# EasyEDA Pro project ProPrj_电刺激发生单元_openTENS_2025-11-25.epro

# Schematic Schematic1
Board Name: 交流脉冲版_v1.1; Create Date: 2024-01-28; Page Name: P1; Project Name: 电刺激发生单元2; Schematic Name: Schematic1; Update Date: 2025-10-31; Company: 嘉立创EDA; Page Size: A4; Version: V1.0
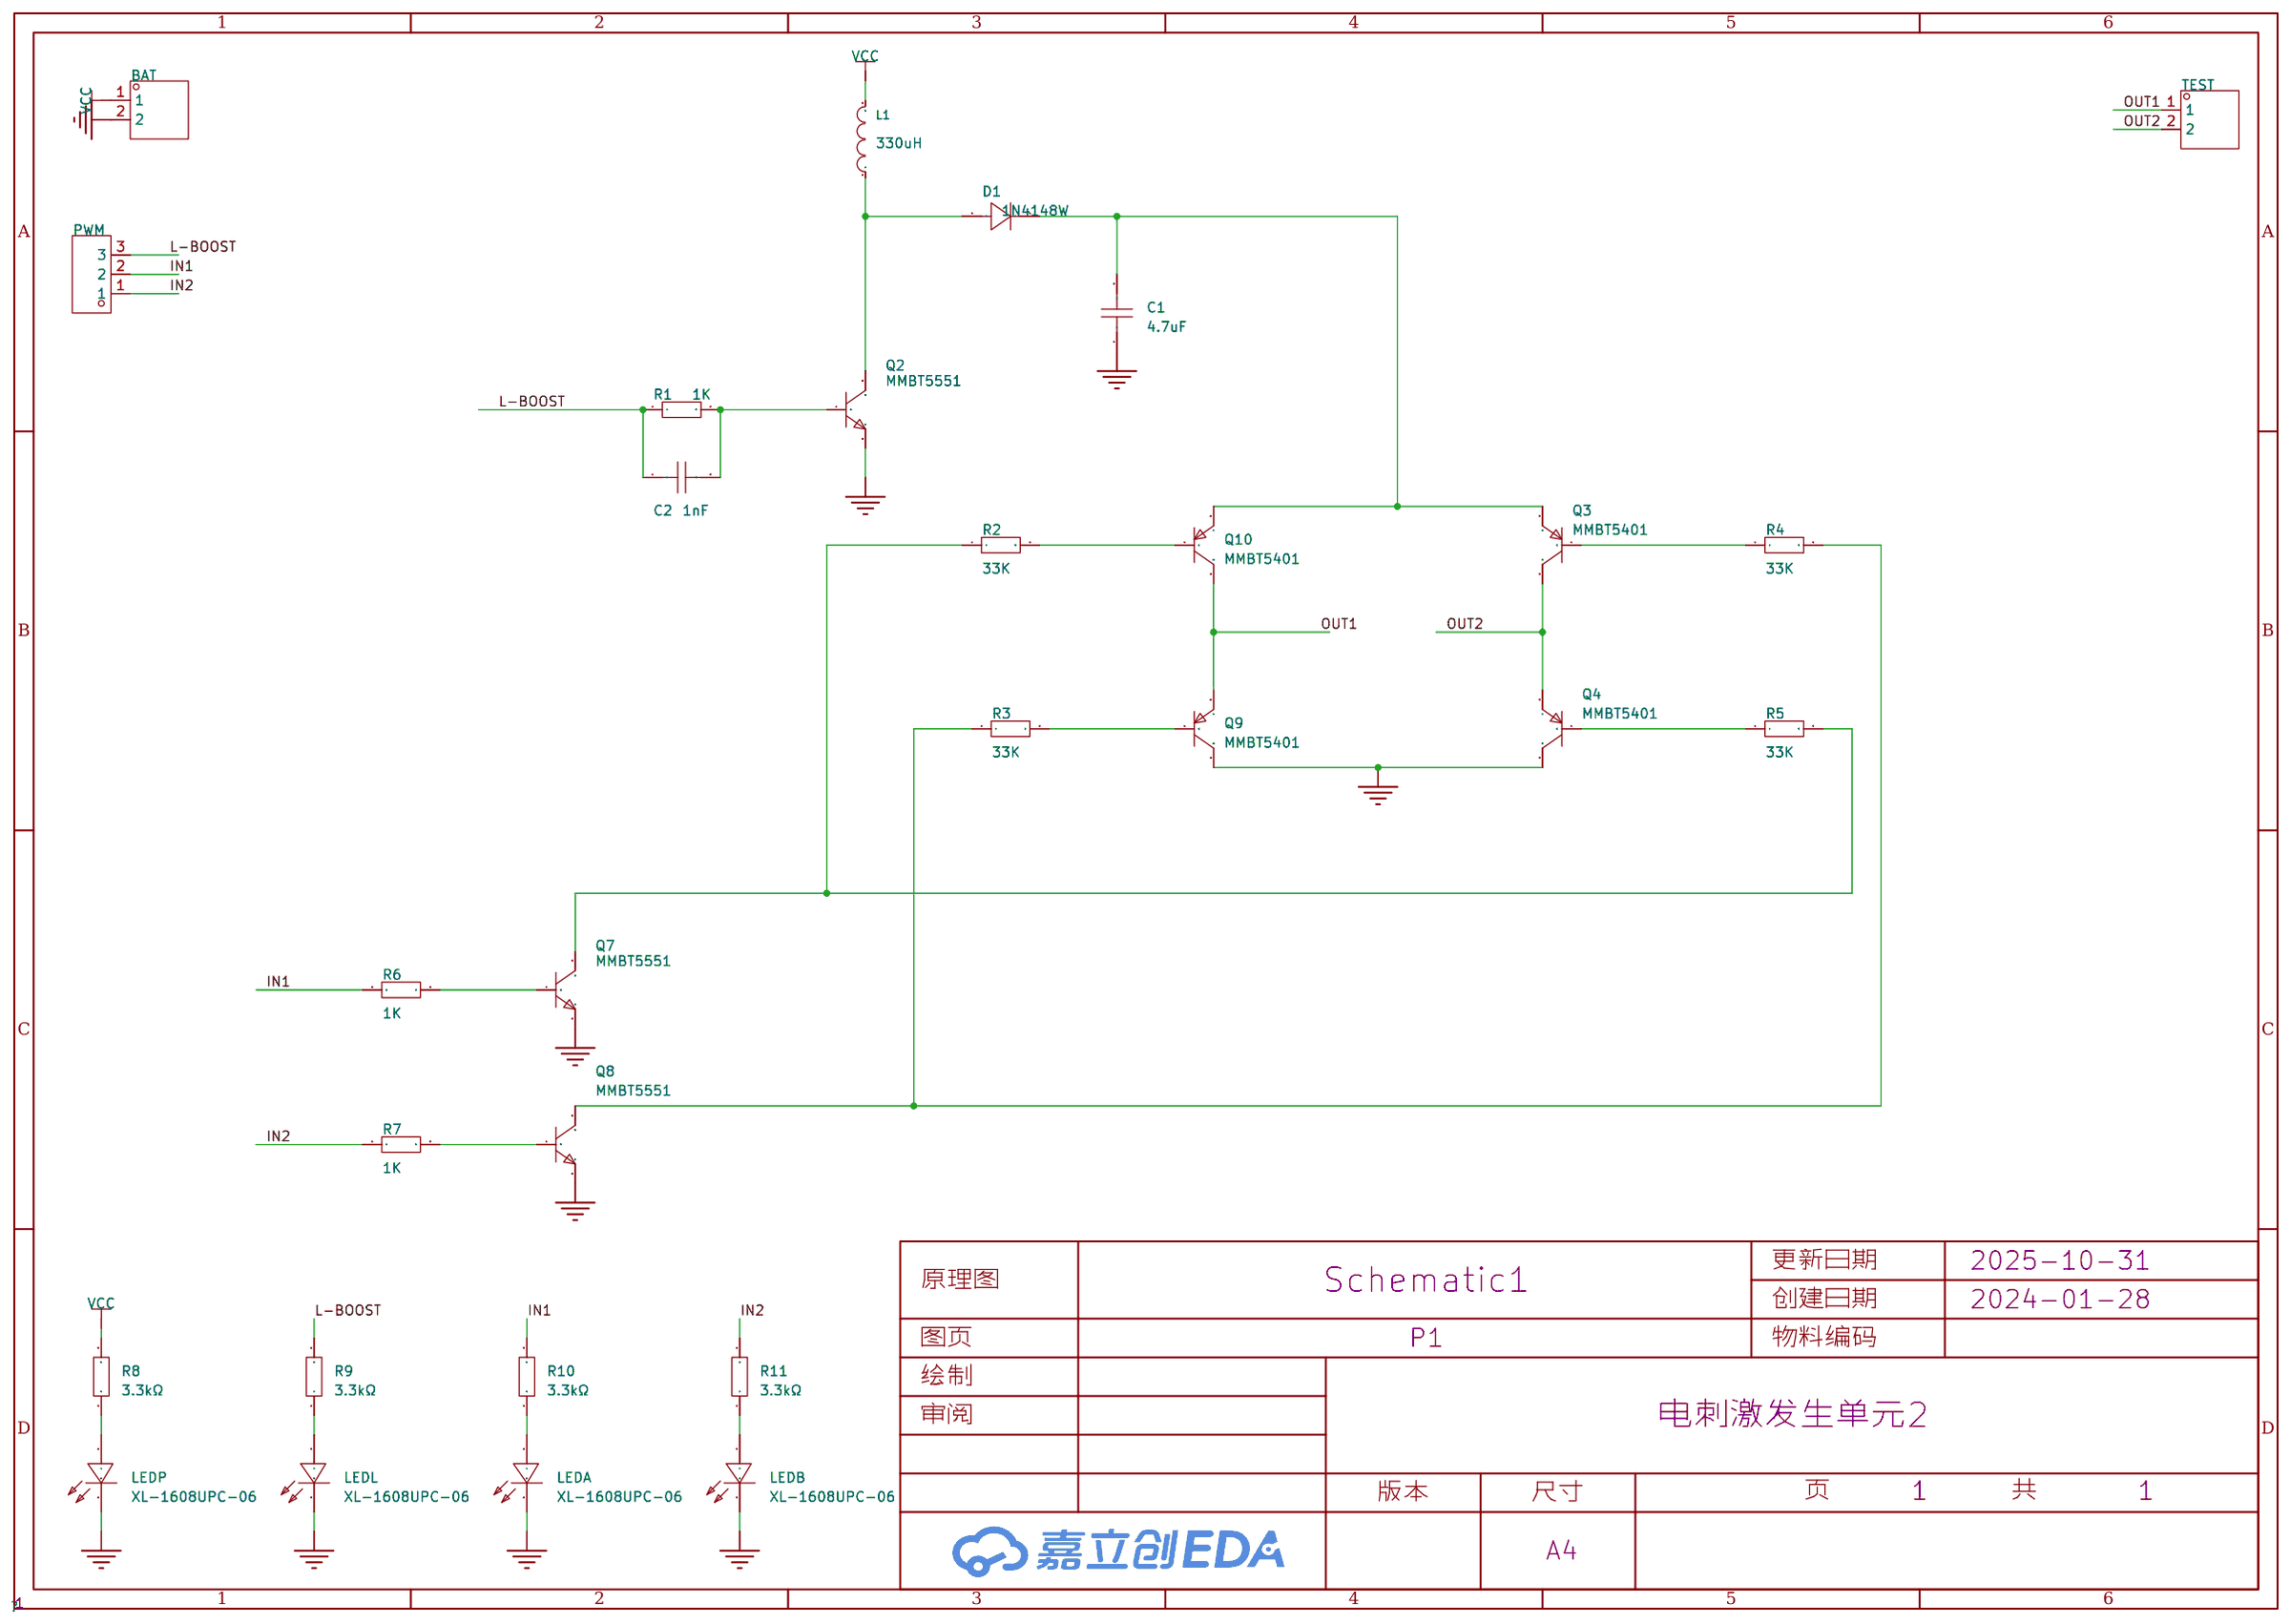
[diagram p0: schematic sheet]

## Parts
BAT  -  [HDR-TH_2P-P2.54-V-M-1]
C1  4.7uF  [C1206]
C2  1nF  [C0603]
D1  1N4148W  [SOD-123_L2.8-W1.8-LS3.7-RD]
L1  330uH  [IND-SMD_L4.0-W4.0_FNR40XXS]
LEDA  XL-1608UPC-06  [LED0603-RD_PINK]
LEDB  XL-1608UPC-06  [LED0603-RD_PINK]
LEDL  XL-1608UPC-06  [LED0603-RD_PINK]
LEDP  XL-1608UPC-06  [LED0603-RD_PINK]
PWM  -  [HDR-TH_3P-P2.54-V-M]
Q2  MMBT5551  [SOT-23-3_L2.9-W1.3-P1.90-LS2.4-BR]
Q3  MMBT5401  [SOT-23-3_L2.9-W1.3-P1.90-LS2.4-BR]
Q4  MMBT5401  [SOT-23-3_L2.9-W1.3-P1.90-LS2.4-BR]
Q7  MMBT5551  [SOT-23-3_L2.9-W1.3-P1.90-LS2.4-BR]
Q8  MMBT5551  [SOT-23-3_L2.9-W1.3-P1.90-LS2.4-BR]
Q9  MMBT5401  [SOT-23-3_L2.9-W1.3-P1.90-LS2.4-BR]
Q10  MMBT5401  [SOT-23-3_L2.9-W1.3-P1.90-LS2.4-BR]
R1  1K  [R0603]
R2  33K  [R0603]
R3  33K  [R0603]
R4  33K  [R0603]
R5  33K  [R0603]
R6  1K  [R0603]
R7  1K  [R0603]
R8  3.3kΩ  [R0603]
R9  3.3kΩ  [R0603]
R10  3.3kΩ  [R0603]
R11  3.3kΩ  [R0603]
TEST  -  [HDR-TH_2P-P2.54-V-M-1]

## Library data of the parts
BAT TEST = HDR-M_2.54_1x2P: Supplier Part: C124375; Supplier Footprint: 插件
C1 = GRM31CC72A475KE11L: 容值:4.7uF;精度:±10%;额定电压:100V;材质(温度系数):X7S;; LCSC Part Name: 4.7uF ±10% 100V; Supplier Part: C237304; Manufacturer: muRata(村田); Supplier Footprint: 1206; JLCPCB Part Class: 扩展库; Datasheet: https://atta.szlcsc.com/upload/public/pdf/source/20200508/C237304_4DE028CC8A94E401326C46A1633456FC.pdf; Supplier: LCSC; Tolerance: ±10%; Voltage Rated: 100V; Temperature Coefficient: X7S
C2 = CL10B102KC8NNNC: 容值:1nF;精度:±10%;额定电压:100V;材质(温度系数):X7R;; LCSC Part Name: 1nF ±10% 100V; Supplier Part: C153291; Manufacturer: SAMSUNG(三星); Supplier Footprint: 0603; JLCPCB Part Class: Extended Part; Datasheet: https://atta.szlcsc.com/upload/public/pdf/source/20160218/1457707763339.pdf; Supplier: LCSC; Tolerance: ±10%; Voltage Rated: 100V; Temperature Coefficient: X7R
D1 = 1N4148W_C2099: 二极管配置:独立式;正向压降(Vf):1.25V@150mA;直流反向耐压(Vr):100V;整流电流:150mA;反向恢复时间(trr):4ns;; LCSC Part Name: 丝印T4; Supplier Part: C2099; Manufacturer: CJ(江苏长电/长晶); Supplier Footprint: SOD-123; JLCPCB Part Class: Extended Part; Datasheet: https://atta.szlcsc.com/upload/public/pdf/source/20120428/1457706480199.pdf; Supplier: LCSC; Diode Configuration: 独立式; Forward Voltage (Vf@If): 1.25V@150mA; Reverse Voltage (Vr): 100V; Rectified Current: 150mA; Reverse Leakage Current: 1uA@75V; Reverse Recovery Time (trr): 4ns
L1 = FNR4030S331MT: 电感值:330uH;精度:±20%;额定电流:260mA;饱和电流(Isat):400mA;; LCSC Part Name: 330uH ±20% 400mA; Supplier Part: C167900; Manufacturer: cjiang(长江微电); Supplier Footprint: SMD,4x4x3mm; JLCPCB Part Class: Extended Part; Datasheet: https://atta.szlcsc.com/upload/public/pdf/source/20190327/C167925_9EFF0AABC4CA629C2CC95961DBF7D39D.pdf; Supplier: LCSC; Tolerance: ±20%; Rated Current: 260mA; DC Resistance (DCR): 5.2Ω; Saturation Current (Isat): 400mA
LEDA LEDB LEDL LEDP = XL-1608UPC-06: 灯头类型:-;发光颜色:粉色;正向电压(VF):-;功率:80mW;正向电流:5mA;主波长:-;二极管配置:-;透镜颜色:粉色透镜;色温:-;发光强度:-;发光角度:120°;载带方式:正贴;工作温度:-30℃~+85℃;; Supplier Part: C2977076; Manufacturer: XINGLIGHT(成兴光); Supplier Footprint: 0603; JLCPCB Part Class: 扩展库; Datasheet: https://atta.szlcsc.com/upload/public/pdf/source/20221102/10CD74551B91639B3CF9699D266872B7.pdf; Supplier: LCSC; Emitted Color: 粉色; Power Dissipation: 80mW; Forward Current: 5mA; Lens Color: 粉色透镜; Viewing Angle: 120°; Mounting Sytle: 正贴; Operating Temperature: -30℃~+85℃
PWM = HDR-M_2.54_1x3P: Supplier Part: C2937625; Supplier Footprint: 插件
Q2 Q7 Q8 = MMBT5551_C511877: 晶体管类型:-;集电极电流(Ic):600mA;集射极击穿电压(Vceo):160V;功率(Pd):300mW;直流电流增益(hFE@Ic,Vce):100@10mA,5V;; LCSC Part Name: 电流:600mA 耐压:160V; Supplier Part: C511877; Manufacturer: BORN(伯恩半导体); Supplier Footprint: SOT-23; JLCPCB Part Class: 扩展库; Datasheet: https://atta.szlcsc.com/upload/public/pdf/source/20200413/C511877_5FB572CA080610ED71DCB0A2B79AF8E8.pdf; Supplier: LCSC; Collector Current (Ic): 600mA; Collector-Emitter Breakdown Voltage (Vceo): 160V; Power Dissipation (Pd): 300mW; DC Current Gain (hFE@Ic,Vce): 100@10mA,5V; Transition Frequency (fT): 300MHz; Collector Cut-Off Current (Icbo): 50nA; Collector-Emitter Saturation Voltage (VCE(sat)@Ic,Ib): 200mV@50mA,5mA
Q3 Q4 Q9 Q10 = MMBT5401_C8326: 晶体管类型:PNP;集电极电流(Ic):600mA;集射极击穿电压(Vceo):150V;功率(Pd):300mW;直流电流增益(hFE@Ic,Vce):200@10mA,5V;; LCSC Part Name: PNP 电流:600mA 耐压:150V hfe=200~300; Supplier Part: C8326; Manufacturer: CJ(江苏长电/长晶); Supplier Footprint: SOT-23; JLCPCB Part Class: 基础库; Datasheet: https://atta.szlcsc.com/upload/public/pdf/source/20140809/1457707213644.pdf; Supplier: LCSC; Transistor Type: PNP; Collector Current (Ic): 600mA; Collector-Emitter Breakdown Voltage (Vceo): 150V; Power Dissipation (Pd): 300mW; DC Current Gain (hFE@Ic,Vce): 200@10mA,5V; Transition Frequency (fT): 100MHz; Collector Cut-Off Current (Icbo): 100nA; Collector-Emitter Saturation Voltage (VCE(sat)@Ic,Ib): 500mV@50mA,5mA
R1-R7 = Res_0603: Supplier Footprint: 0603
R8-R11 = 0603WAF3301T5E: 阻值:3.3kΩ;精度:±1%;功率:100mW;温度系数:±100ppm/℃;电阻类型:厚膜电阻;; LCSC Part Name: 3.3kΩ ±1% 100mW 厚膜电阻; Supplier Part: C22978; Manufacturer: UNI-ROYAL(厚声); Supplier Footprint: 0603; JLCPCB Part Class: 基础库; Datasheet: https://atta.szlcsc.com/upload/public/pdf/source/20200306/C422600_1E6D84923E4A46A82E41ADD87F860B5C.pdf; Supplier: LCSC; Tolerance: ±1%; Power(Watts): 100mW; Overload Voltage (Max): 75V; Temperature Coefficient: ±100ppm/℃; Type: 厚膜电阻; Operating Temperature Range: -55℃~+155℃

## Nets
GND: BAT.2 C1.1 LEDA.1(C) LEDB.1(C) LEDL.1(C) LEDP.1(C) Q2.2(E) Q4.3(C) Q7.2(E) Q8.2(E) Q9.3(C)
VCC: BAT.1 L1.2 R8.2
IN1: PWM.2 R6.1 R10.2
IN2: PWM.1 R7.1 R11.2
L-BOOST: C2.1 PWM.3 R1.1 R9.2
OUT1: Q9.2(E) Q10.3(C) TEST.1
OUT2: Q3.3(C) Q4.2(E) TEST.2
$1N633: C2.2 Q2.1(B) R1.2
$1N635: C1.2 D1.1(K) Q3.2(E) Q10.2(E)
$1N636: Q10.1(B) R2.2
$1N637: Q4.1(B) R5.1
$1N638: Q9.1(B) R3.2
$1N639: Q7.3(C) R2.1 R5.2
$1N640: Q3.1(B) R4.1
$1N641: Q8.3(C) R3.1 R4.2
$1N644: Q7.1(B) R6.2
$1N645: Q8.1(B) R7.2
$1N1569: D1.2(A) L1.1 Q2.3(C)
$1N3237: LEDP.2(A) R8.1
$1N5710: LEDL.2(A) R9.1
$1N5808: LEDA.2(A) R10.1
$1N5903: LEDB.2(A) R11.1

# Schematic Schematic2
Board Name: 直流脉冲版_v1.0; Create Date: 2024-02-03; Page Name: P1; Project Name: 电刺激发生单元2; Schematic Name: Schematic2; Update Date: 2025-10-31; Company: 嘉立创EDA; Page Size: A4; Version: V1.0
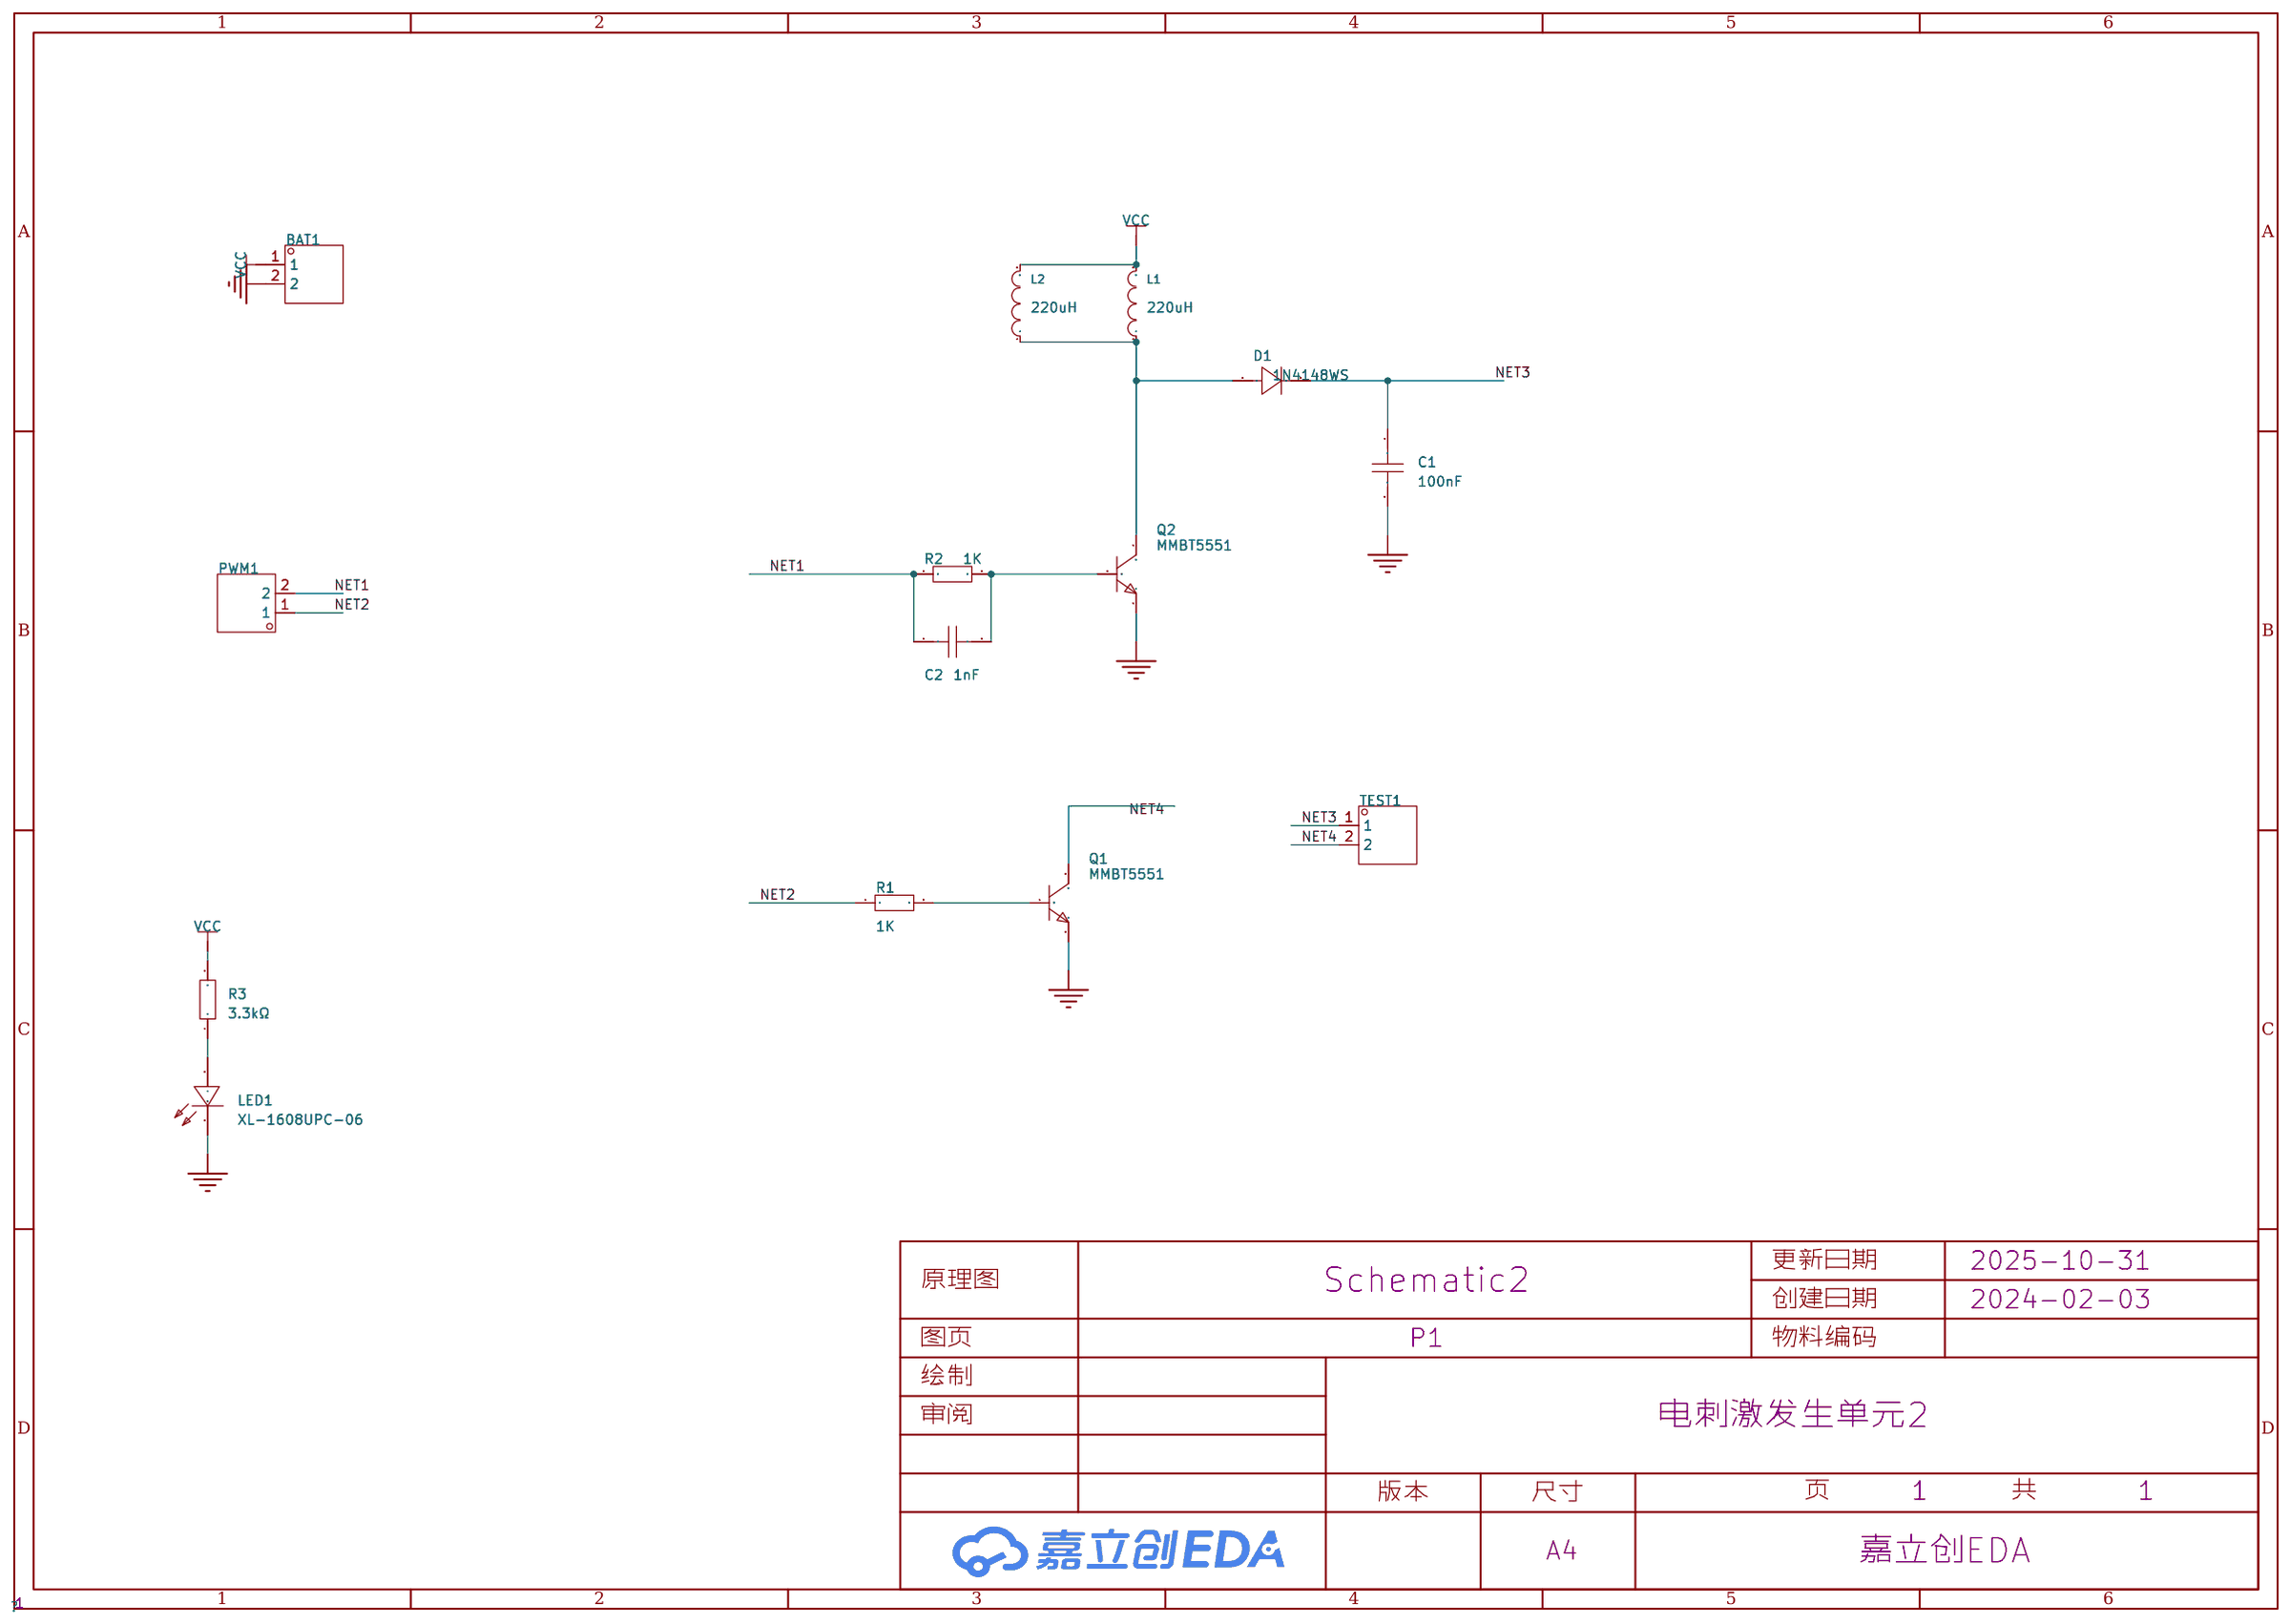
[diagram p1: schematic sheet]

## Parts
BAT1  -  [HDR-TH_2P-P2.54-V-M-1]
C1  100nF  [C1206]
C2  1nF  [C0603]
D1  1N4148WS  [SOD-323_L1.8-W1.3-LS2.5-RD]
L1  220uH  [IND-SMD_L3.0-W3.0_LVS303015H-2R2M-N]
L2  220uH  [L1207]
LED1  XL-1608UPC-06  [LED0603-RD_PINK]
PWM1  -  [HDR-TH_2P-P2.54-V-M-1]
Q1  MMBT5551  [SOT-23-3_L2.9-W1.3-P1.90-LS2.4-BR]
Q2  MMBT5551  [SOT-23-3_L2.9-W1.3-P1.90-LS2.4-BR]
R1  1K  [R0603]
R2  1K  [R0603]
R3  3.3kΩ  [R0603]
TEST1  -  [HDR-TH_2P-P2.54-V-M-1]

## Library data of the parts
BAT1 PWM1 TEST1 = HDR-M_2.54_1x2P: Supplier Part: C124375; Supplier Footprint: 插件
C1 = 1206B104K101NT: 容值:100nF;精度:±10%;额定电压:100V;材质(温度系数):X7R;; LCSC Part Name: 100nF ±10% 100V; Supplier Part: C110255; Manufacturer: FH(风华); Supplier Footprint: 1206; JLCPCB Part Class: Extended Part; Datasheet: https://atta.szlcsc.com/upload/public/pdf/source/20200305/C486355_26A10D38EF8C2A5C37091D0039909270.pdf; Supplier: LCSC; Tolerance: ±10%; Voltage Rated: 100V; Temperature Coefficient: X7R
C2 = CL10B102KC8NNNC: 容值:1nF;精度:±10%;额定电压:100V;材质(温度系数):X7R;; LCSC Part Name: 1nF ±10% 100V; Supplier Part: C153291; Manufacturer: SAMSUNG(三星); Supplier Footprint: 0603; JLCPCB Part Class: Extended Part; Datasheet: https://atta.szlcsc.com/upload/public/pdf/source/20160218/1457707763339.pdf; Supplier: LCSC; Tolerance: ±10%; Voltage Rated: 100V; Temperature Coefficient: X7R
D1 = 1N4148WS_C727111: 二极管配置:独立式;正向压降(Vf):1.25V@150mA;直流反向耐压(Vr):100V;平均整流电流(Io):300mA;功率:400mW;反向恢复时间(trr):8ns;; LCSC Part Name: 电压:100V 电流:300mA; Supplier Part: C727111; Manufacturer: TWGMC(台湾迪嘉); Supplier Footprint: SOD-323; JLCPCB Part Class: Extended Part; Datasheet: https://atta.szlcsc.com/upload/public/pdf/source/20200828/C727111_E7108F014A9288D320E3440593CCDF54.pdf; Supplier: LCSC; Diode Configuration: 独立式; Forward Voltage (Vf@If): 1.25V@150mA; Reverse Voltage (Vr): 100V; Average Rectified Current (Io): 300mA; Power Dissipation: 400mW; Reverse Leakage Current: 1uA@75V; Reverse Recovery Time (trr): 8ns; Operating Temperature: -55℃~+150℃@(Tj)
L1 = XRCD32-221K: 电感值:220uH;精度:±10%;; LCSC Part Name: 220uH ±10%; Supplier Part: C5289391; Manufacturer: XR(祥如); Supplier Footprint: SMD,2.1x3mm; JLCPCB Part Class: Extended Part; Datasheet: https://atta.szlcsc.com/upload/public/pdf/source/20231010/F8DFC35BD01DC108FC822E3F44DEF6B3.pdf; Supplier: LCSC; Tolerance: ±10%; Rated Current: 260mA; DC Resistance (DCR): 5.2Ω; Saturation Current (Isat): 400mA
L2 = LB3218T221M: 电感值:220uH;精度:±20%;额定电流:80mA;饱和电流(Isat):-;直流电阻(DCR):5.4Ω;; LCSC Part Name: 220uH ±20%; Supplier Part: C223393; Manufacturer: TAIYO YUDEN(太诱); Supplier Footprint: 1206; JLCPCB Part Class: Extended Part; Datasheet: https://atta.szlcsc.com/upload/public/pdf/source/20190423/C223308_BFD65E337BAACD8D50F53C3994BF310F.pdf; Supplier: LCSC; Tolerance: ±20%; Rated Current: 80mA; DC Resistance (DCR): 5.4Ω; Frequency - Self Resonant: 252kHz; Type: 绕线片式电感
LED1 = XL-1608UPC-06: 灯头类型:-;发光颜色:粉色;正向电压(VF):-;功率:80mW;正向电流:5mA;主波长:-;二极管配置:-;透镜颜色:粉色透镜;色温:-;发光强度:-;发光角度:120°;载带方式:正贴;工作温度:-30℃~+85℃;; Supplier Part: C2977076; Manufacturer: XINGLIGHT(成兴光); Supplier Footprint: 0603; JLCPCB Part Class: 扩展库; Datasheet: https://atta.szlcsc.com/upload/public/pdf/source/20221102/10CD74551B91639B3CF9699D266872B7.pdf; Supplier: LCSC; Emitted Color: 粉色; Power Dissipation: 80mW; Forward Current: 5mA; Lens Color: 粉色透镜; Viewing Angle: 120°; Mounting Sytle: 正贴; Operating Temperature: -30℃~+85℃
Q1 Q2 = MMBT5551_C511877: 晶体管类型:-;集电极电流(Ic):600mA;集射极击穿电压(Vceo):160V;功率(Pd):300mW;直流电流增益(hFE@Ic,Vce):100@10mA,5V;; LCSC Part Name: 电流:600mA 耐压:160V; Supplier Part: C511877; Manufacturer: BORN(伯恩半导体); Supplier Footprint: SOT-23; JLCPCB Part Class: 扩展库; Datasheet: https://atta.szlcsc.com/upload/public/pdf/source/20200413/C511877_5FB572CA080610ED71DCB0A2B79AF8E8.pdf; Supplier: LCSC; Collector Current (Ic): 600mA; Collector-Emitter Breakdown Voltage (Vceo): 160V; Power Dissipation (Pd): 300mW; DC Current Gain (hFE@Ic,Vce): 100@10mA,5V; Transition Frequency (fT): 300MHz; Collector Cut-Off Current (Icbo): 50nA; Collector-Emitter Saturation Voltage (VCE(sat)@Ic,Ib): 200mV@50mA,5mA
R1 R2 = Res_0603: Supplier Footprint: 0603
R3 = 0603WAF3301T5E: 阻值:3.3kΩ;精度:±1%;功率:100mW;温度系数:±100ppm/℃;电阻类型:厚膜电阻;; LCSC Part Name: 3.3kΩ ±1% 100mW 厚膜电阻; Supplier Part: C22978; Manufacturer: UNI-ROYAL(厚声); Supplier Footprint: 0603; JLCPCB Part Class: 基础库; Datasheet: https://atta.szlcsc.com/upload/public/pdf/source/20200306/C422600_1E6D84923E4A46A82E41ADD87F860B5C.pdf; Supplier: LCSC; Tolerance: ±1%; Power(Watts): 100mW; Overload Voltage (Max): 75V; Temperature Coefficient: ±100ppm/℃; Type: 厚膜电阻; Operating Temperature Range: -55℃~+155℃

## Nets
GND: BAT1.2 C1.2 LED1.1(C) Q1.2(E) Q2.2(E)
VCC: BAT1.1 L1.2 L2.2 R3.2
NET1: C2.1 PWM1.2 R2.1
NET2: PWM1.1 R1.1
NET3: C1.1 D1.1(K) TEST1.1
NET4: Q1.3(C) TEST1.2
$1N914: C2.2 Q2.1(B) R2.2
$1N925: Q1.1(B) R1.2
$1N950: LED1.2(A) R3.1
$1N1295: D1.2(A) L1.1 L2.1 Q2.3(C)

# Schematic Schematic3
Board Name: 开源_交流脉冲版_v2; Create Date: 2025-11-19; Page Name: P1; Project Name: 电刺激发生单元2; Schematic Name: Schematic1_1; Update Date: 2025-11-19; Company: 嘉立创EDA; Page Size: A4; Version: V1.0
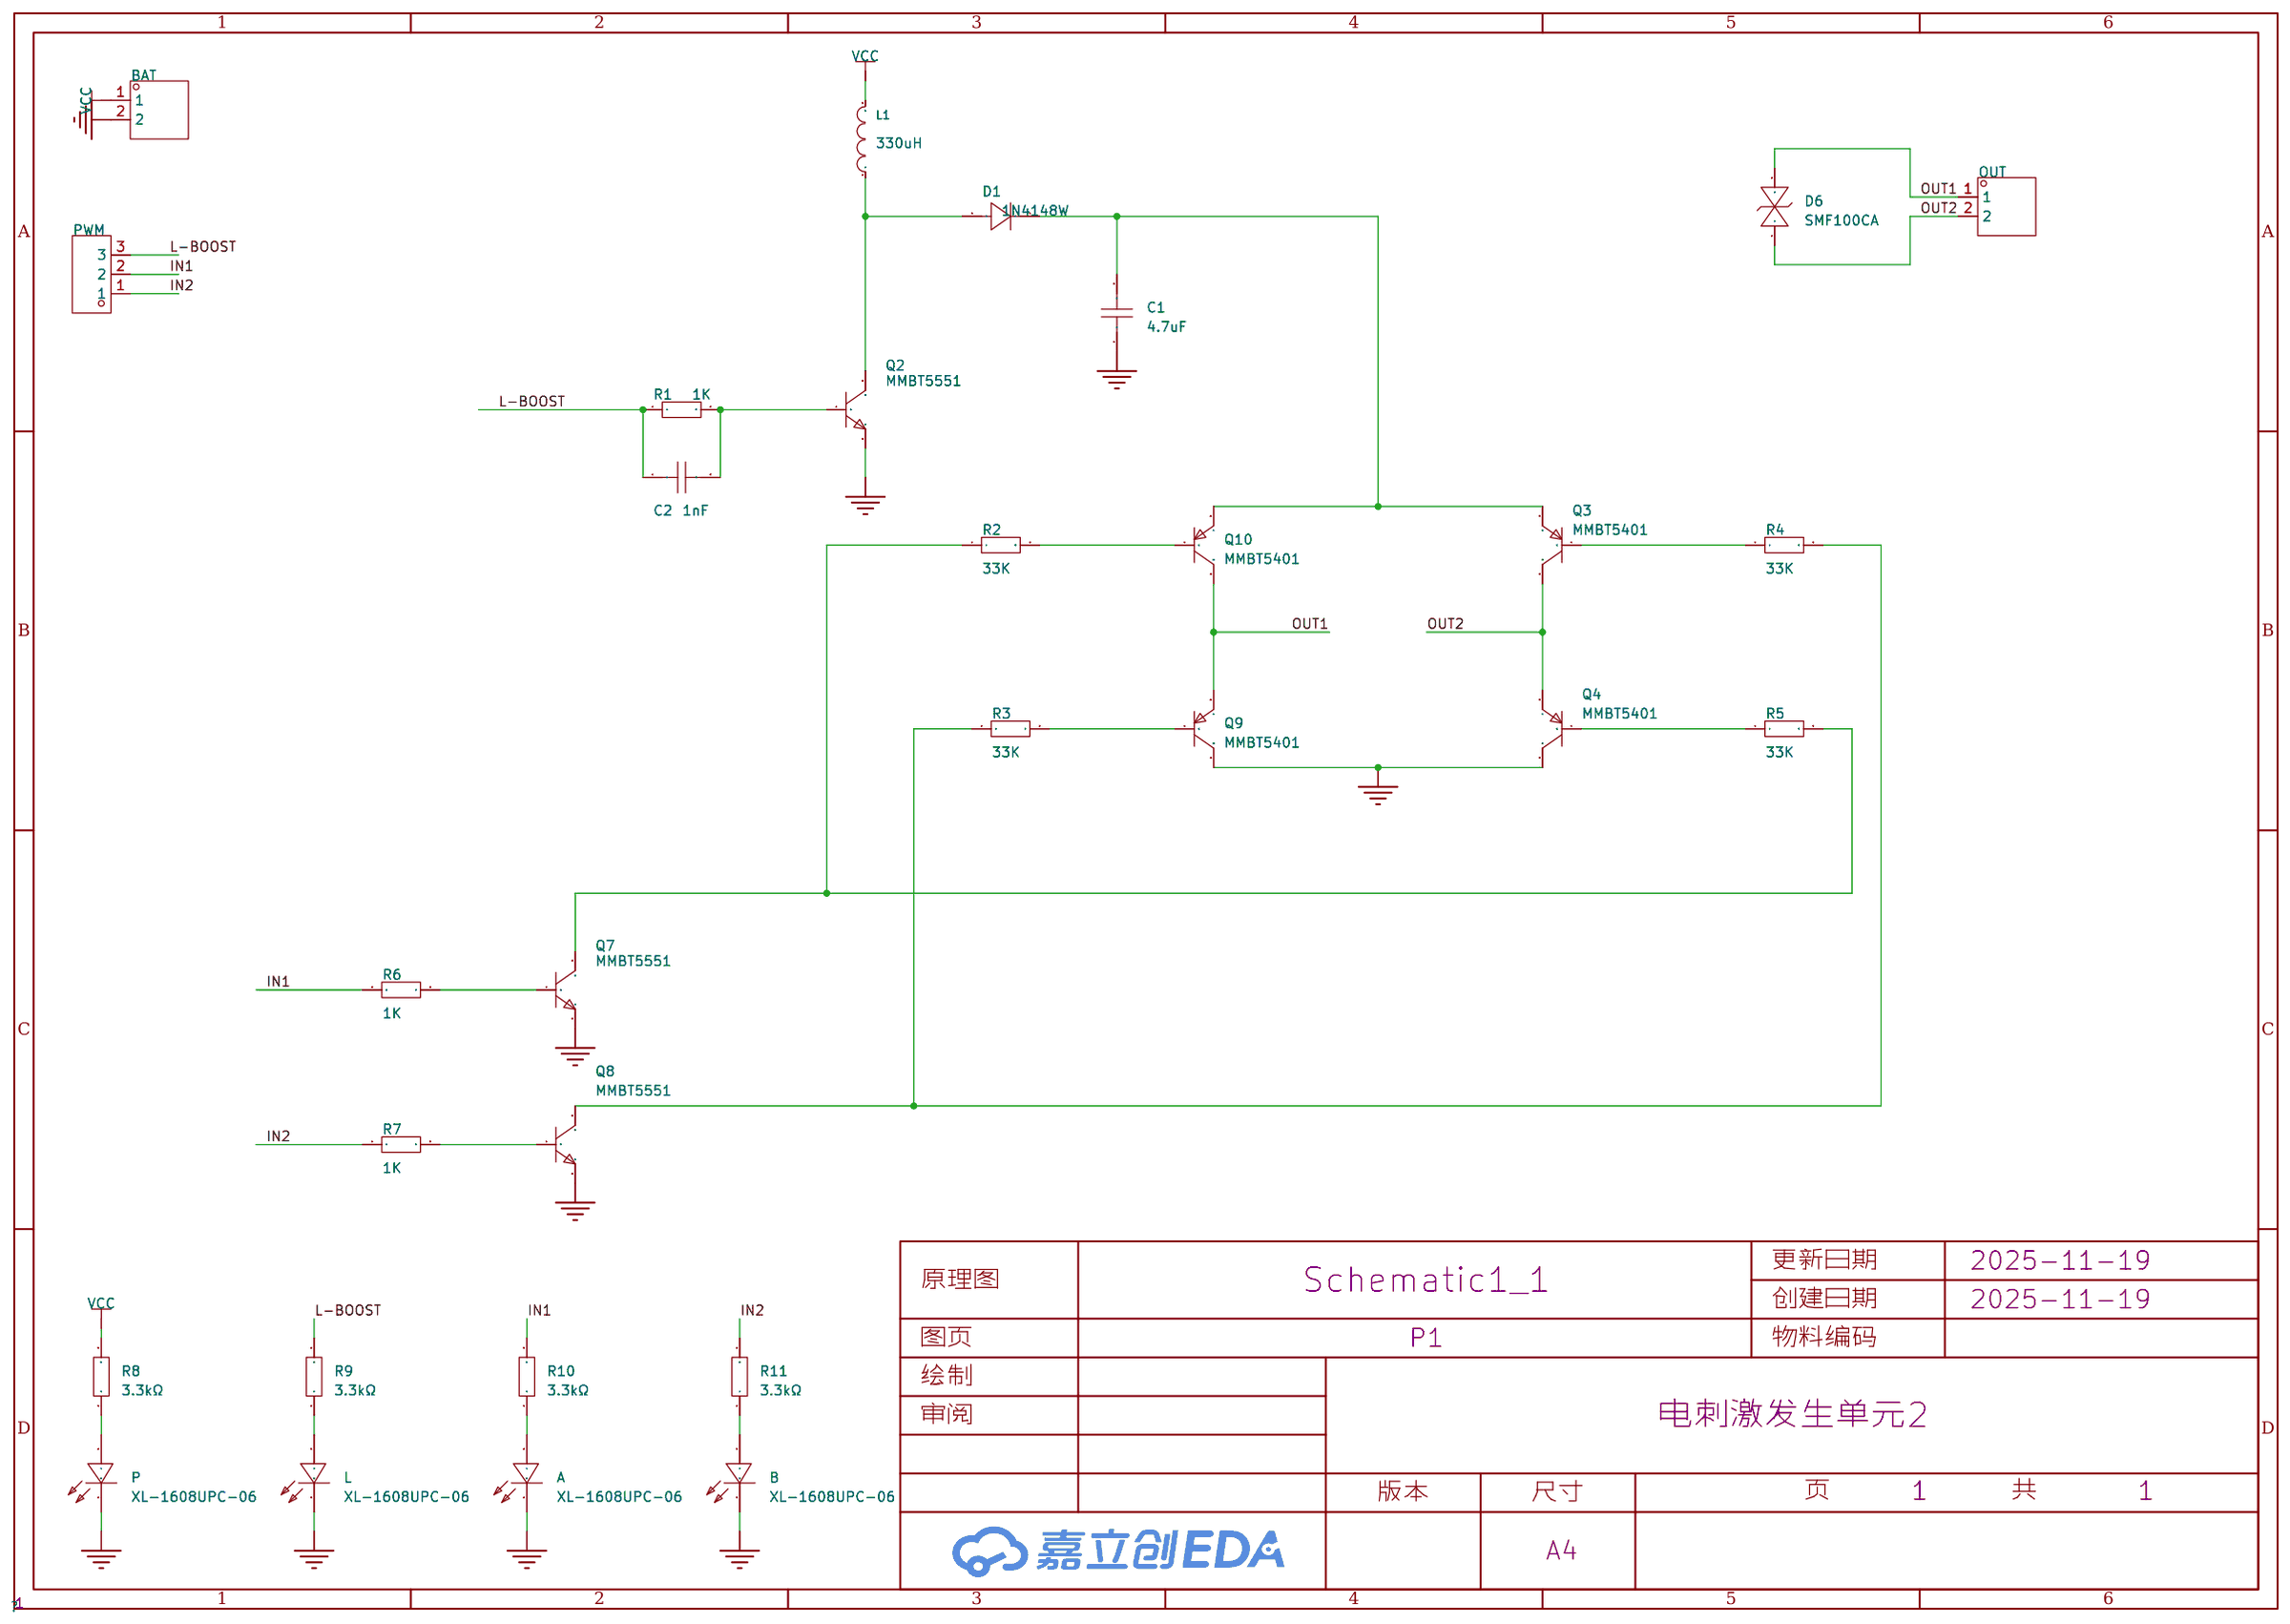
[diagram p2: schematic sheet]

## Parts
A  XL-1608UPC-06  [LED0603-RD_PINK]
B  XL-1608UPC-06  [LED0603-RD_PINK]
BAT  -  [HDR-TH_2P-P2.54-V-M-1]
C1  4.7uF  [C1206]
C2  1nF  [C0603]
D1  1N4148W  [SOD-123_L2.8-W1.8-LS3.7-RD]
D6  SMF100CA  [SOD-123FL_L2.8-W1.8-LS3.7-BI]
L  XL-1608UPC-06  [LED0603-RD_PINK]
L1  330uH  [IND-SMD_L4.0-W4.0_FNR40XXS]
OUT  -  [HDR-TH_2P-P2.54-V-M-1]
P  XL-1608UPC-06  [LED0603-RD_PINK]
PWM  -  [HDR-TH_3P-P2.54-V-M]
Q2  MMBT5551  [SOT-23-3_L2.9-W1.3-P1.90-LS2.4-BR]
Q3  MMBT5401  [SOT-23-3_L2.9-W1.3-P1.90-LS2.4-BR]
Q4  MMBT5401  [SOT-23-3_L2.9-W1.3-P1.90-LS2.4-BR]
Q7  MMBT5551  [SOT-23-3_L2.9-W1.3-P1.90-LS2.4-BR]
Q8  MMBT5551  [SOT-23-3_L2.9-W1.3-P1.90-LS2.4-BR]
Q9  MMBT5401  [SOT-23-3_L2.9-W1.3-P1.90-LS2.4-BR]
Q10  MMBT5401  [SOT-23-3_L2.9-W1.3-P1.90-LS2.4-BR]
R1  1K  [R0603]
R2  33K  [R0603]
R3  33K  [R0603]
R4  33K  [R0603]
R5  33K  [R0603]
R6  1K  [R0603]
R7  1K  [R0603]
R8  3.3kΩ  [R0603]
R9  3.3kΩ  [R0603]
R10  3.3kΩ  [R0603]
R11  3.3kΩ  [R0603]

## Library data of the parts
A B L P = XL-1608UPC-06: 灯头类型:-;发光颜色:粉色;正向电压(VF):-;功率:80mW;正向电流:5mA;主波长:-;二极管配置:-;透镜颜色:粉色透镜;色温:-;发光强度:-;发光角度:120°;载带方式:正贴;工作温度:-30℃~+85℃;; Supplier Part: C2977076; Manufacturer: XINGLIGHT(成兴光); Supplier Footprint: 0603; JLCPCB Part Class: 扩展库; Datasheet: https://atta.szlcsc.com/upload/public/pdf/source/20221102/10CD74551B91639B3CF9699D266872B7.pdf; Supplier: LCSC; Emitted Color: 粉色; Power Dissipation: 80mW; Forward Current: 5mA; Lens Color: 粉色透镜; Viewing Angle: 120°; Mounting Sytle: 正贴; Operating Temperature: -30℃~+85℃
BAT OUT = HDR-M_2.54_1x2P: Supplier Part: C124375; Supplier Footprint: 插件
C1 = GRM31CC72A475KE11L: 容值:4.7uF;精度:±10%;额定电压:100V;材质(温度系数):X7S;; LCSC Part Name: 4.7uF ±10% 100V; Supplier Part: C237304; Manufacturer: muRata(村田); Supplier Footprint: 1206; JLCPCB Part Class: 扩展库; Datasheet: https://atta.szlcsc.com/upload/public/pdf/source/20200508/C237304_4DE028CC8A94E401326C46A1633456FC.pdf; Supplier: LCSC; Tolerance: ±10%; Voltage Rated: 100V; Temperature Coefficient: X7S
C2 = CL10B102KC8NNNC: 容值:1nF;精度:±10%;额定电压:100V;材质(温度系数):X7R;; LCSC Part Name: 1nF ±10% 100V; Supplier Part: C153291; Manufacturer: SAMSUNG(三星); Supplier Footprint: 0603; JLCPCB Part Class: Extended Part; Datasheet: https://atta.szlcsc.com/upload/public/pdf/source/20160218/1457707763339.pdf; Supplier: LCSC; Tolerance: ±10%; Voltage Rated: 100V; Temperature Coefficient: X7R
D1 = 1N4148W_C2099: 二极管配置:独立式;正向压降(Vf):1.25V@150mA;直流反向耐压(Vr):100V;整流电流:150mA;反向恢复时间(trr):4ns;; LCSC Part Name: 丝印T4; Supplier Part: C2099; Manufacturer: CJ(江苏长电/长晶); Supplier Footprint: SOD-123; JLCPCB Part Class: Extended Part; Datasheet: https://atta.szlcsc.com/upload/public/pdf/source/20120428/1457706480199.pdf; Supplier: LCSC; Diode Configuration: 独立式; Forward Voltage (Vf@If): 1.25V@150mA; Reverse Voltage (Vr): 100V; Rectified Current: 150mA; Reverse Leakage Current: 1uA@75V; Reverse Recovery Time (trr): 4ns
D6 = SMF100CA_C726978: 极性:双向;反向截止电压(Vrwm):100V;最大钳位电压:162V;峰值脉冲电流(Ipp):1.1A;峰值脉冲功率(Ppp):200W;击穿电压:123V;; Supplier Part: C726978; Manufacturer: TWGMC(台湾迪嘉); Supplier Footprint: SOD-123FL; JLCPCB Part Class: Extended Part; Datasheet: https://atta.szlcsc.com/upload/public/pdf/source/20240221/82542CC24D3FF23C8D7724B636AB7D4B.pdf; Supplier: LCSC; polarity: 双向; Reverse Stand-Off Voltage (Vrwm): 100V; Maximum Clamping Voltage: 162V; Peak Pulse Current (Ipp): 1.1A; Peak Pulse Power Dissipation (Ppp): 200W; Breakdown Voltage: 123V; Reverse Leakage Current (Ir): 1uA; Number of Lines: 单路; Operating Temperature: -55℃~+150℃; Type: TVS
L1 = FNR4030S331MT: 电感值:330uH;精度:±20%;额定电流:260mA;饱和电流(Isat):400mA;; LCSC Part Name: 330uH ±20% 400mA; Supplier Part: C167900; Manufacturer: cjiang(长江微电); Supplier Footprint: SMD,4x4x3mm; JLCPCB Part Class: Extended Part; Datasheet: https://atta.szlcsc.com/upload/public/pdf/source/20190327/C167925_9EFF0AABC4CA629C2CC95961DBF7D39D.pdf; Supplier: LCSC; Tolerance: ±20%; Rated Current: 260mA; DC Resistance (DCR): 5.2Ω; Saturation Current (Isat): 400mA
PWM = HDR-M_2.54_1x3P: Supplier Part: C2937625; Supplier Footprint: 插件
Q2 Q7 Q8 = MMBT5551_C511877: 晶体管类型:-;集电极电流(Ic):600mA;集射极击穿电压(Vceo):160V;功率(Pd):300mW;直流电流增益(hFE@Ic,Vce):100@10mA,5V;; LCSC Part Name: 电流:600mA 耐压:160V; Supplier Part: C511877; Manufacturer: BORN(伯恩半导体); Supplier Footprint: SOT-23; JLCPCB Part Class: 扩展库; Datasheet: https://atta.szlcsc.com/upload/public/pdf/source/20200413/C511877_5FB572CA080610ED71DCB0A2B79AF8E8.pdf; Supplier: LCSC; Collector Current (Ic): 600mA; Collector-Emitter Breakdown Voltage (Vceo): 160V; Power Dissipation (Pd): 300mW; DC Current Gain (hFE@Ic,Vce): 100@10mA,5V; Transition Frequency (fT): 300MHz; Collector Cut-Off Current (Icbo): 50nA; Collector-Emitter Saturation Voltage (VCE(sat)@Ic,Ib): 200mV@50mA,5mA
Q3 Q4 Q9 Q10 = MMBT5401_C8326: 晶体管类型:PNP;集电极电流(Ic):600mA;集射极击穿电压(Vceo):150V;功率(Pd):300mW;直流电流增益(hFE@Ic,Vce):200@10mA,5V;; LCSC Part Name: PNP 电流:600mA 耐压:150V hfe=200~300; Supplier Part: C8326; Manufacturer: CJ(江苏长电/长晶); Supplier Footprint: SOT-23; JLCPCB Part Class: 基础库; Datasheet: https://atta.szlcsc.com/upload/public/pdf/source/20140809/1457707213644.pdf; Supplier: LCSC; Transistor Type: PNP; Collector Current (Ic): 600mA; Collector-Emitter Breakdown Voltage (Vceo): 150V; Power Dissipation (Pd): 300mW; DC Current Gain (hFE@Ic,Vce): 200@10mA,5V; Transition Frequency (fT): 100MHz; Collector Cut-Off Current (Icbo): 100nA; Collector-Emitter Saturation Voltage (VCE(sat)@Ic,Ib): 500mV@50mA,5mA
R1-R7 = Res_0603: Supplier Footprint: 0603
R8-R11 = 0603WAF3301T5E: 阻值:3.3kΩ;精度:±1%;功率:100mW;温度系数:±100ppm/℃;电阻类型:厚膜电阻;; LCSC Part Name: 3.3kΩ ±1% 100mW 厚膜电阻; Supplier Part: C22978; Manufacturer: UNI-ROYAL(厚声); Supplier Footprint: 0603; JLCPCB Part Class: 基础库; Datasheet: https://atta.szlcsc.com/upload/public/pdf/source/20200306/C422600_1E6D84923E4A46A82E41ADD87F860B5C.pdf; Supplier: LCSC; Tolerance: ±1%; Power(Watts): 100mW; Overload Voltage (Max): 75V; Temperature Coefficient: ±100ppm/℃; Type: 厚膜电阻; Operating Temperature Range: -55℃~+155℃

## Nets
GND: A.1(C) B.1(C) BAT.2 C1.1 L.1(C) P.1(C) Q2.2(E) Q4.3(C) Q7.2(E) Q8.2(E) Q9.3(C)
VCC: BAT.1 L1.2 R8.2
IN1: PWM.2 R6.1 R10.2
IN2: PWM.1 R7.1 R11.2
L-BOOST: C2.1 PWM.3 R1.1 R9.2
OUT1: D6.2 OUT.1 Q9.2(E) Q10.3(C)
OUT2: D6.1 OUT.2 Q3.3(C) Q4.2(E)
$1N633: C2.2 Q2.1(B) R1.2
$1N635: C1.2 D1.1(K) Q3.2(E) Q10.2(E)
$1N636: Q10.1(B) R2.2
$1N637: Q4.1(B) R5.1
$1N638: Q9.1(B) R3.2
$1N639: Q7.3(C) R2.1 R5.2
$1N640: Q3.1(B) R4.1
$1N641: Q8.3(C) R3.1 R4.2
$1N644: Q7.1(B) R6.2
$1N645: Q8.1(B) R7.2
$1N1569: D1.2(A) L1.1 Q2.3(C)
$1N3237: P.2(A) R8.1
$1N5710: L.2(A) R9.1
$1N5808: A.2(A) R10.1
$1N5903: B.2(A) R11.1

# Schematic Schematic4
Board Name: openTense开源_2.54to2.5mm转接板_v1; Create Date: 2025-11-25; Page Name: P1; Project Name: 电刺激发生单元_openTENS; Schematic Name: Schematic4; Update Date: 2025-11-25; Company: 嘉立创EDA; Page Size: A4; Version: V1.0
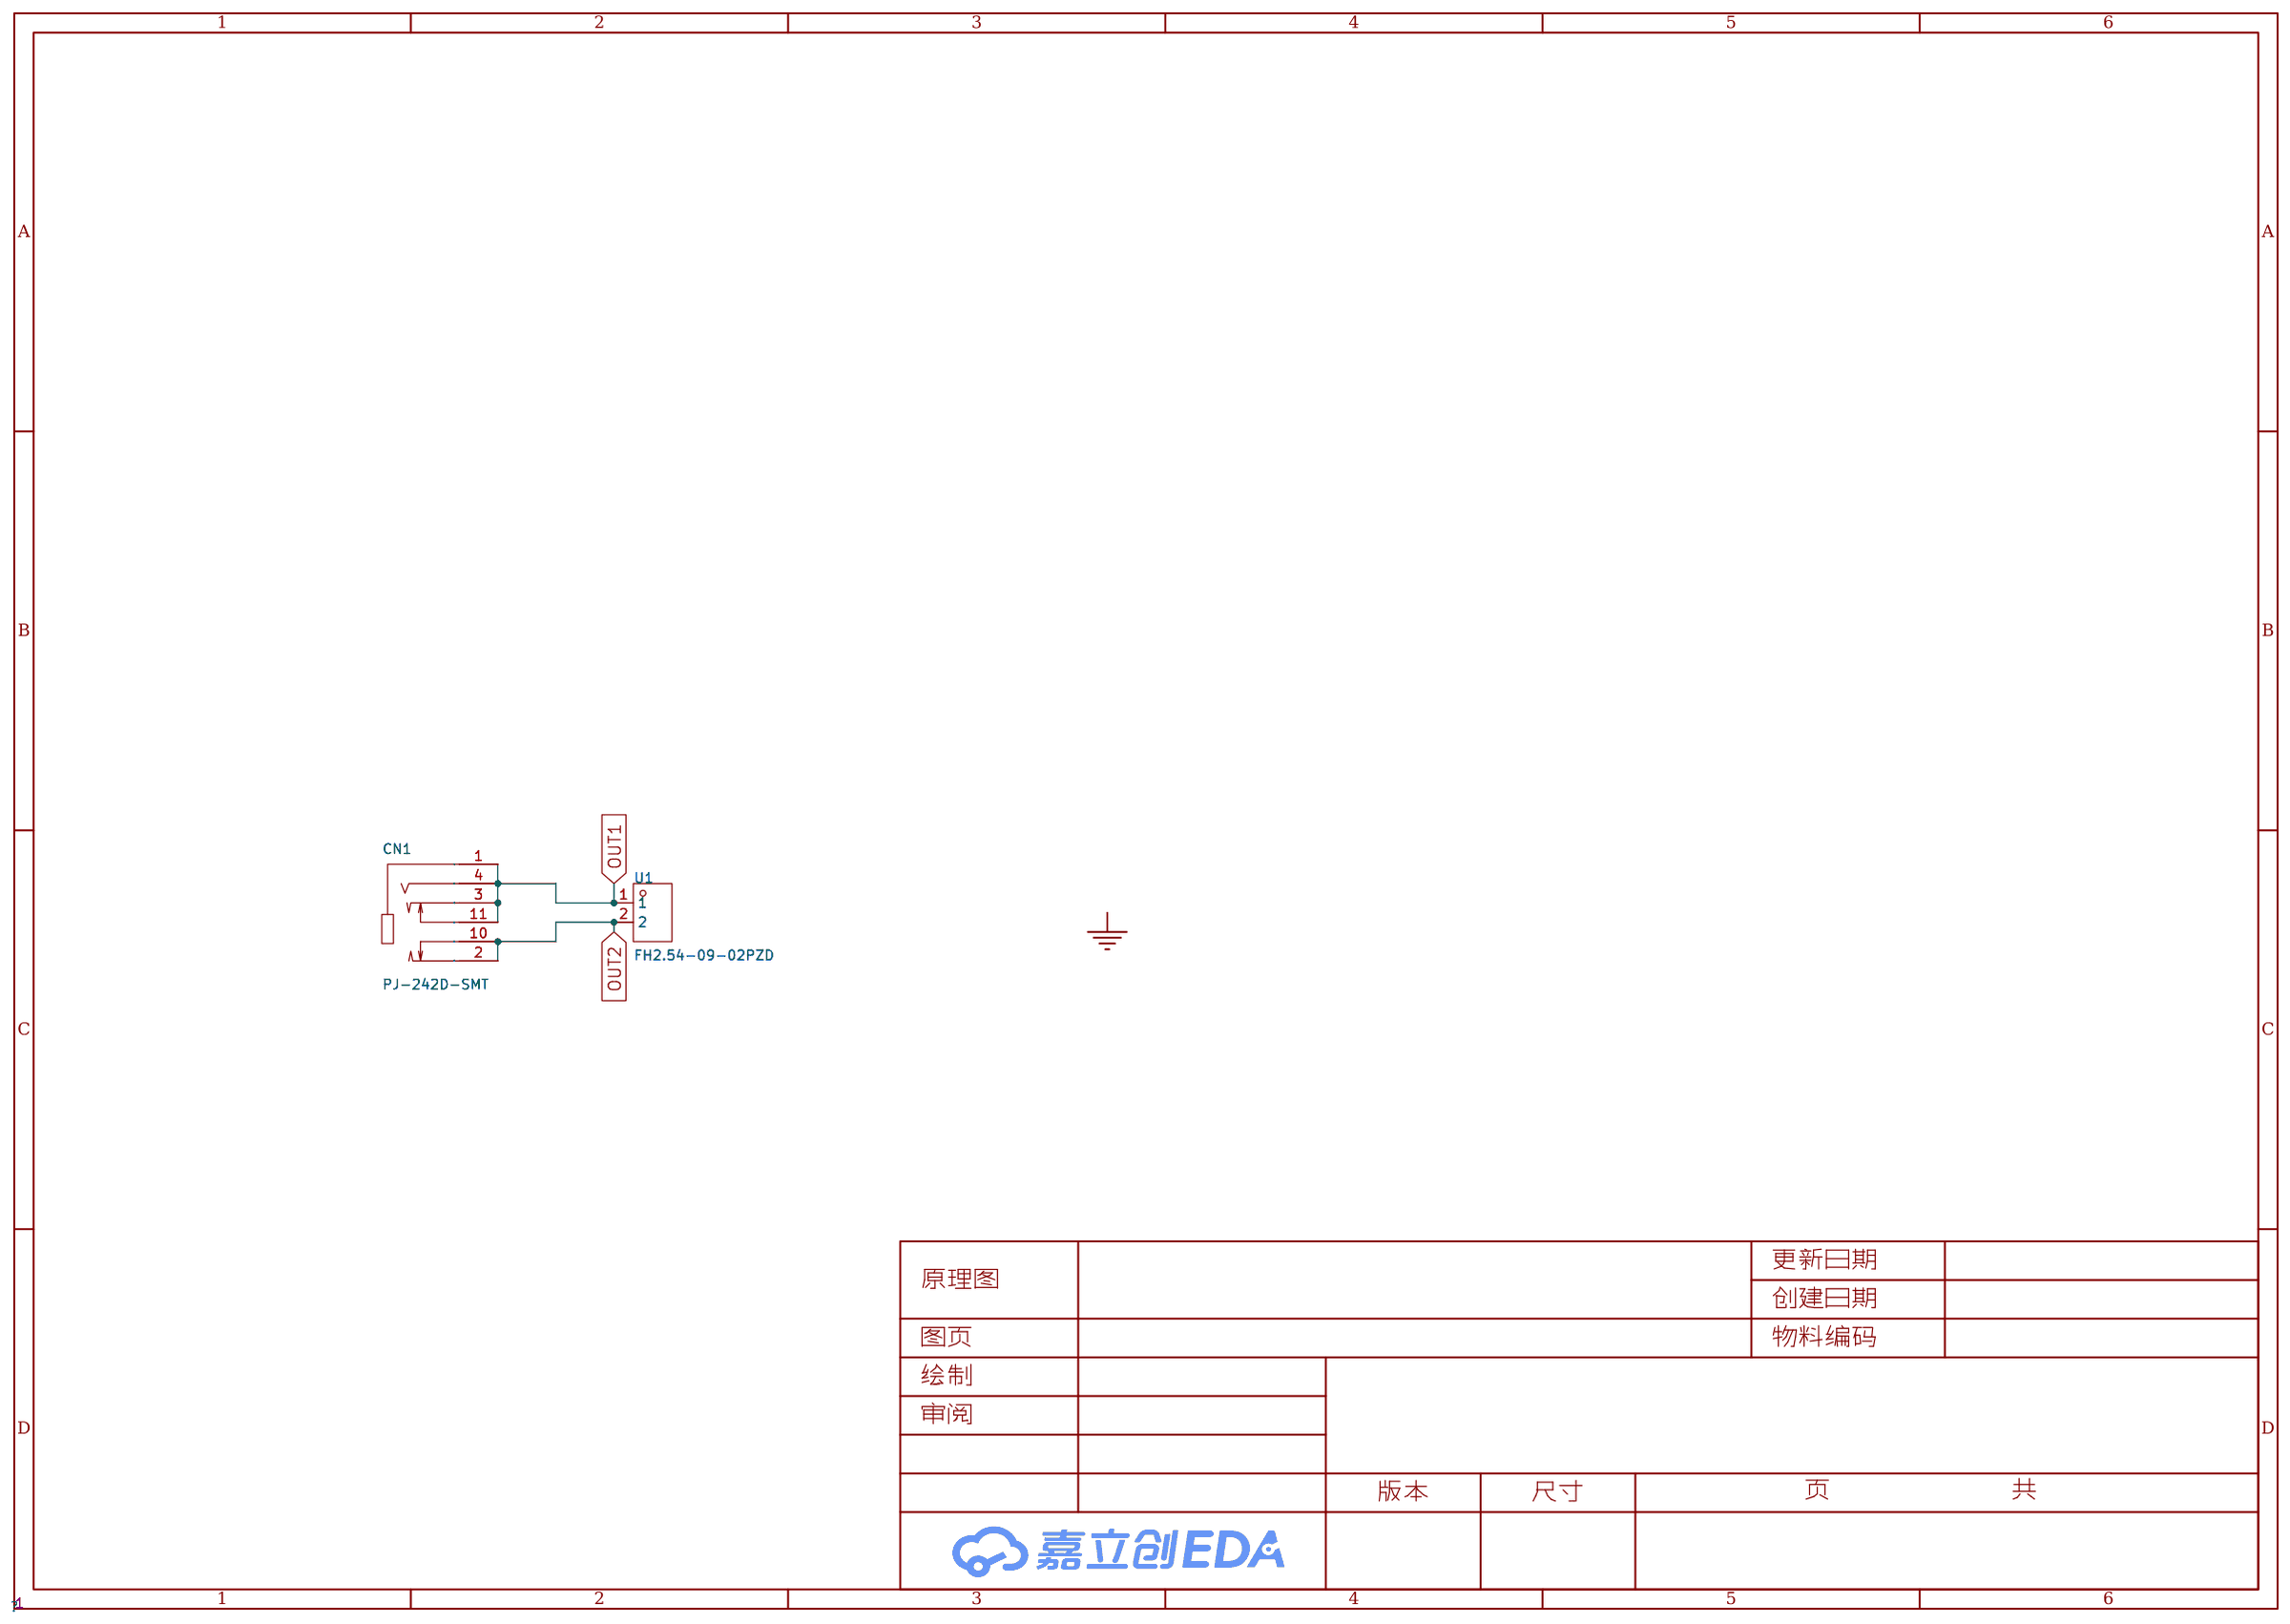
[diagram p3: schematic sheet]

## Parts
CN1  PJ-242D-SMT  [AUDIO-SMD_PJ-242D-SMT]
U1  FH2.54-09-02PZD  [HDR-TH_2P-P2.54-V-M-5]

## Library data of the parts
CN1 = PJ-242D-SMT: 连接器类型:2.5mm耳机座;额定电流:500mA;额定电压:30V;工作温度范围:-20℃~+70℃;焊接温度(最大值):235℃;; LCSC Part Name: 2.5mm耳机座; Supplier Part: C381133; Manufacturer: XKB Connectivity(中国星坤); Supplier Footprint: SMD; JLCPCB Part Class: 扩展库; Datasheet: https://atta.szlcsc.com/upload/public/pdf/source/20231017/7280E886D0997069091FEF77D1A28ADC.pdf; Supplier: LCSC; Connector Type: 2.5mm耳机座; Current Rating (Max): 500mA; Voltage Rating (Max): 30V; Operating Temperature Range: -20℃~+70℃; Soldering Temperature(Max): 235℃
U1 = FH2.54-09-02PZD: 插孔结构:1x2P;间距:2.54mm;圆孔/方孔:方孔;安装方式:直插;排数:单排;总孔位数:2P;额定电流:3A;插孔方向:顶部;塑高:8.5mm;触头材质:黄铜;触头镀层:金;工作温度:-40℃~+105℃;; LCSC Part Name: 1x2P 间距:2.54mm 直插; Supplier Part: C7500771; Manufacturer: XUNPU(讯普); Supplier Footprint: 插件,P=2.54mm; JLCPCB Part Class: 扩展库; Datasheet: https://item.szlcsc.com/datasheet/FH2.54-09-02PZD/8579575.html; Supplier: LCSC; Holes Structure: 1x2P; Pitch: 2.54mm; Circular Hole / Square Hole: 方孔; Mounting Type: 直插; Number of Rows: 单排; Number of Positions: 2P; Current Rating: 3A; Holes Direction: 顶部; Insulation Height: 8.5mm; Contact Material: 黄铜; Contact Plating: 金; Operating Temperature: -40℃~+105℃; PIN Length: 3.2mm

## Nets
OUT1: CN1.1 CN1.3 CN1.4 CN1.11 U1.1
OUT2: CN1.2 CN1.10 U1.2

# Board PCB1
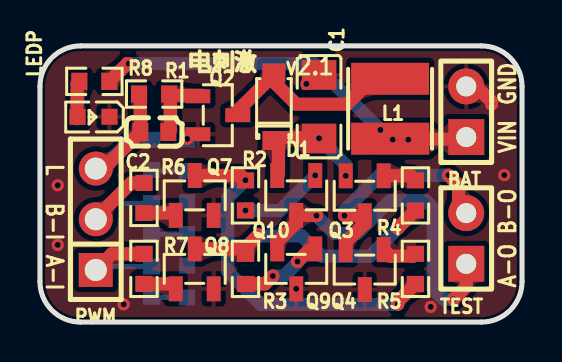
[diagram p4: board, top side]
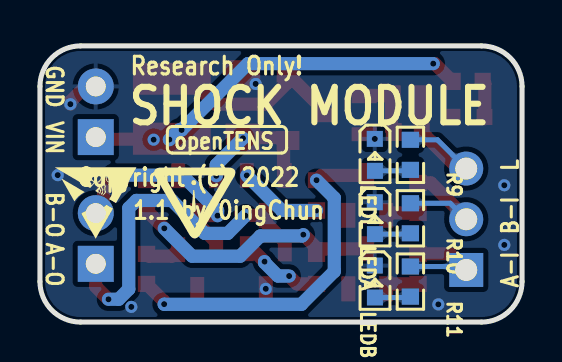
[diagram p5: board, bottom side, seen from below]

Outline 24.13 x 13.84 mm; copper layers: Top Layer, Bottom Layer. Coordinates in mm from the lower left corner of the outline.
Outline path: 0,11.81 0,2.03 arc(0.6,0.6) 2.03,0 22.1,0 arc(23.53,0.6) 24.13,2.03 24.13,11.81 arc(23.53,13.25) 22.1,13.84 2.03,13.84 arc(0.6,13.25) 0,11.81
Stack: Top Layer 0.035mm / Dielectric1 1.51mm FR4 er 4.5 / Bottom Layer 0.035mm

## Design rules (mm)
template: JLCPCB Capability(Two Layers Board)
spacing copperThickness1oz (default): track to track 0.102, other pairs 0.152 to 0.3
spacing copperThickness2oz: track to track 0.203, other pairs 0.152 to 0.3
track width copperThickness1oz (default): min 0.127, default 0.254, max 2.54
track width copperThickness2oz: min 0.203, default 0.254, max 2.54
differential pair differentialPair (default): width min 0.127, default 0.254, max 2.54; gap min 0.152, default 0.152
via viaSize (default): diameter min 0.5, default 0.61, max 10; hole min 0.3, default 0.305, max 6.3

## Placement (name value [footprint] x y rotation side)
BAT  -  [HDR-TH_2P-P2.54-V-M-1]  21.34 10.54 90 top
C1  4.7uF  [C1206]  13.97 10.8 270 top
C2  1nF  [C0603]  5.72 9.53 0 top
D1  1N4148W  [SOD-123_L2.8-W1.8-LS3.7-RD]  11.71 10.8 90 top
L1  330uH  [IND-SMD_L4.0-W4.0_FNR40XXS]  17.53 10.69 270 top
LEDA  XL-1608UPC-06  [LED0603-RD_PINK]  7.37 5.21 270 bottom
LEDB  XL-1608UPC-06  [LED0603-RD_PINK]  7.37 2.03 270 bottom
LEDL  XL-1608UPC-06  [LED0603-RD_PINK]  7.37 8.38 270 bottom
LEDP  XL-1608UPC-06  [LED0603-RD_PINK]  2.68 10.29 180 top
PWM  -  [HDR-TH_3P-P2.54-V-M]  2.79 5.15 90 top
Q2  MMBT5551  [SOT-23-3_L2.9-W1.3-P1.90-LS2.4-BR]  8.9 10.37 180 top
Q3  MMBT5401  [SOT-23-3_L2.9-W1.3-P1.90-LS2.4-BR]  16.26 6.33 90 top
Q4  MMBT5401  [SOT-23-3_L2.9-W1.3-P1.90-LS2.4-BR]  16.26 2.63 90 top
Q7  MMBT5551  [SOT-23-3_L2.9-W1.3-P1.90-LS2.4-BR]  7.75 6.35 270 top
Q8  MMBT5551  [SOT-23-3_L2.9-W1.3-P1.90-LS2.4-BR]  7.75 2.67 270 top
Q9  MMBT5401  [SOT-23-3_L2.9-W1.3-P1.90-LS2.4-BR]  12.83 2.67 90 top
Q10  MMBT5401  [SOT-23-3_L2.9-W1.3-P1.90-LS2.4-BR]  12.83 6.35 90 top
R1  1K  [R0603]  5.72 11.43 0 top
R2  33K  [R0603]  10.29 6.35 270 top
R3  33K  [R0603]  10.29 2.67 270 top
R4  33K  [R0603]  18.8 6.35 270 top
R5  33K  [R0603]  18.8 2.67 270 top
R6  1K  [R0603]  5.21 6.22 270 top
R7  1K  [R0603]  5.21 2.67 270 top
R8  3.3kΩ  [R0603]  2.72 12.06 0 top
R9  3.3kΩ  [R0603]  5.59 8.38 90 bottom
R10  3.3kΩ  [R0603]  5.59 5.2 90 bottom
R11  3.3kΩ  [R0603]  5.59 2.03 90 bottom
TEST  -  [HDR-TH_2P-P2.54-V-M-1]  21.34 4.19 90 top

## Footprints (pads in the part's own frame, mm; a bottom-side part is the same pattern mirrored in y, then rotated)
C0603
  rect 0.8x0.9 smd: 1(-0.7,0) 2(0.7,0)
C1206
  rect 1.485x1.728 smd: 1(-1.593,0) 2(1.593,0)
HDR-TH_2P-P2.54-V-M-1
  rect 1.8x1.8 hole 1: 1(-1.27,0)
  round 1.8 hole 1: 2(1.27,0)
HDR-TH_3P-P2.54-V-M
  rect 1.7x1.7 hole 1.1: 1(-2.54,0)
  round 1.7 hole 1.1: 2(0,0) 3(2.54,0)
IND-SMD_L4.0-W4.0_FNR40XXS
  rect 1.6x3.9 smd: 1(-1.5,0) 2(1.5,0)
LED0603-RD_PINK
  rect 0.8x0.8 smd: 1(-0.799,-0.004) 2(0.799,0.004)
R0603
  rect 0.806x0.864 smd: 1(-0.753,0) 2(0.753,0)
SOD-123_L2.8-W1.8-LS3.7-RD
  rect 0.95x1.15 smd: 1(-1.692,0) 2(1.692,0)
SOT-23-3_L2.9-W1.3-P1.90-LS2.4-BR
  rect 1.25x0.7 smd: 1(1,-0.95) 2(1,0.95) 3(-1,0)

## Nets
As in the schematic.

## Via types
v1: diameter 0.61, hole 0.305, Top Layer to Bottom Layer, 27 vias

## Routing (per net, layer and track width the routed paths; a pad name or vN(x,y) marks a point on that pad's centre or on a via; arc(x,y) is an arc through that point)
GND: length 1.7
  Top Layer w0.66: v1(22.61,10.92) 22.61,11.05 21.84,11.81 BAT.2
  vias: v1(0.89,6.86) v1(0.89,3.87) v1(4.19,0.89) v1(7.37,9.18) v1(12.83,1.67) v1(13.34,11.94) v1(19.56,0.76) v1(23.24,7.37)
VCC: length 21.4
  Top Layer w0.66: 3.48,12.06 4.37,12.95 v1(4.44,12.95) ; 16.13,9.14 16.13,9.17 21.23,9.17 BAT.1
  Bottom Layer w0.66: v1(17.65,9.14) 17.17,9.63 v1(17.04,9.63) 13.72,12.95 v1(4.44,12.95)
  vias: v1(18.44,9.14)
IN1: length 6.3
  Top Layer w0.66: PWM.2 2.79,5.21 4.56,6.98 R6.1
  Bottom Layer w0.254: PWM.2 3.6,5.96 5.59,5.96
IN2: length 5.6
  Top Layer w0.66: R7.1 3.6,3.42 2.79,2.61
  Bottom Layer w0.254: 2.79,2.61 2.97,2.79 R11.2
L-BOOST: length 8.3
  Top Layer w0.66: 5.03,11.43 5.03,9.53 C2.1 3.19,7.69 PWM.3
  Bottom Layer w0.254: PWM.3 4.24,9.14 R9.2
OUT1: length 17.5
  Top Layer w0.66: Q9.2 11.88,4.03 12.83,4.98 Q10.3 13.83,5.35 v1(13.84,5.33) ; TEST.1 21.34,1.78 v1(20.7,1.14)
  Bottom Layer w0.66: v1(20.7,1.14) 20.19,1.14 19.69,1.65 19.69,5.72 19.3,6.1 17.53,6.1 15.88,4.45 14.73,4.45 v1(13.84,5.33)
OUT2: length 11.6
  Top Layer w0.66: v1(15.24,5.33) 16.25,5.33 ; TEST.2 20.96,5.84 20.96,6.86 v1(20.45,7.37) ; Q3.3 16.26,4.95 15.31,4 Q4.2
  Bottom Layer w0.66: v1(20.45,7.37) 17.02,7.37 15.24,5.59 v1(15.24,5.33)
$1N633: length 3.5
  Top Layer w0.66: 8.14,11.36 6.53,11.36 6.53,9.63 C2.2
$1N635: length 6.4
  Top Layer w0.254: 11.94,7.41 Q10.2
  Top Layer w0.66: 11.94,7.41 11.94,9.24 13.94,9.24 v1(13.97,9.21)
  Bottom Layer w0.66: v1(13.97,9.21) 15.31,7.88 v1(15.31,7.33)
$1N636: length 4.2
  Bottom Layer w0.66: v1(13.78,7.35) 12.02,5.6 v1(10.29,5.6)
$1N637: length 1.8
  Top Layer w0.66: Q4.1 17.54,3.3 18.68,3.3 R5.1
$1N638: length 4.2
  Top Layer w0.66: R3.2 11.26,1.91 v1(11.66,2.31) ; Q9.1 13.7,3.59 13.45,3.59 v1(12.89,3.03)
  Bottom Layer w0.66: v1(12.89,3.03) 12.89,2.98 12.22,2.31 v1(11.66,2.31)
$1N639: length 18.2
  Top Layer w0.66: v1(10.29,7.11) R2.1 10.04,7.35 Q7.3 ; v1(17.91,0.9) 17.91,1.03 R5.2
  Bottom Layer w0.66: v1(17.91,0.9) 17.9,0.89 11.05,0.89 9.4,2.54 9.4,6.22 v1(10.29,7.11)
$1N640: length 1.7
  Top Layer w0.66: Q3.1 18.57,7.33 R4.1
$1N641: length 13.1
  Top Layer w0.66: v1(17.91,4.7) 17.91,4.71 R4.2 ; v1(10.95,4.38) 10.29,3.72 R3.1 10.04,3.67 Q8.3
  Bottom Layer w0.66: v1(10.95,4.38) 11.01,4.32 13.1,4.32 14.11,3.3 16.51,3.3 v1(17.91,4.7)
$1N644: length 1.6
  Top Layer w0.66: Q7.1 6.68,5.47 R6.2
$1N645: length 1.7
  Top Layer w0.66: R7.2 6.55,1.91 Q8.1
$1N1569: length 10.2
  Top Layer w0.66: 11.77,12.36 11.77,11.98 12.83,10.92 15.37,10.92 16.61,12.17 17.4,12.17 ; D1.2 11.71,12.41 9.75,10.45 9.78,10.41 10.14,10.41
$1N3237: length 1.9
  Top Layer w0.66: 1.86,10.19 1.86,11.95 1.98,12.06
$1N5710: length 1.8
  Bottom Layer w0.254: LEDL.2 5.63,7.58 R9.1
$1N5808: length 1.8
  Bottom Layer w0.254: LEDA.2 5.63,4.41 R10.1
$1N5903: length 1.8
  Bottom Layer w0.254: LEDB.2 5.63,1.23 R11.1

## Copper pours and planes (outline as drawn; the poured copper is in the pictures)
GND on Top Layer: -1.14,14.99 25.27,14.99 25.27,-1.27 -1.14,-1.27
GND on Bottom Layer: -0.51,14.86 26.03,14.86 26.03,-1.52 -0.51,-1.52

Small or netless copper shapes (teardrops, artwork), in the pictures only: 52 on Top Layer, 16 on Bottom Layer

## Text on the board
Bottom Silkscreen Layer: GND | VIN | L | B-I | A-I | B-O | A-O | openTENS | 1.1 by 0ingChun | Research Only! | Copyright (c) 2022 | SHOCK MODULE
Top Silkscreen Layer: GND | VIN | B-O | A-O | L | B-I | A-I | v2.1 | 电刺激

# Board PCB2
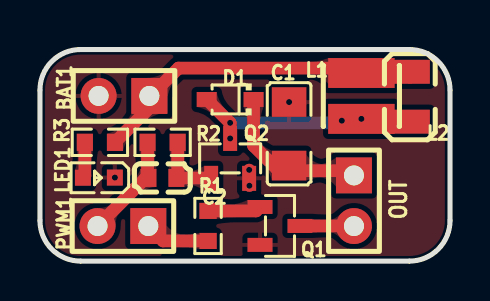
[diagram p6: board, top side]
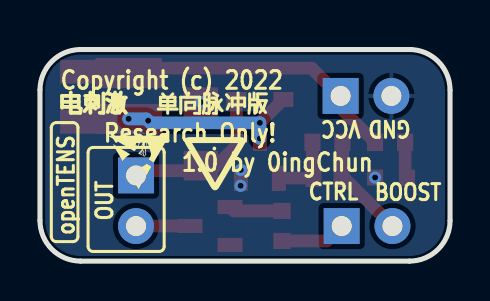
[diagram p7: board, bottom side, seen from below]

Outline 20.52 x 10.61 mm; copper layers: Top Layer, Bottom Layer. Coordinates in mm from the lower left corner of the outline.
Outline path: 0,8.58 0,2.03 arc(0.6,0.6) 2.03,0 18.48,0 arc(19.92,0.6) 20.52,2.03 20.52,8.58 arc(19.92,10.01) 18.48,10.61 2.03,10.61 arc(0.6,10.01) 0,8.58
Stack: Top Layer 0.035mm / Dielectric1 1.51mm FR4 er 4.5 / Bottom Layer 0.035mm

## Design rules (mm)
template: JLCPCB Capability(Two Layers Board)
spacing copperThickness1oz (default): track to track 0.102, other pairs 0.152 to 0.3
spacing copperThickness2oz: track to track 0.203, other pairs 0.152 to 0.3
track width copperThickness1oz (default): min 0.127, default 0.254, max 2.54
track width copperThickness2oz: min 0.203, default 0.254, max 2.54
differential pair differentialPair (default): width min 0.127, default 0.254, max 2.54; gap min 0.152, default 0.152
via viaSize (default): diameter min 0.5, default 0.61, max 10; hole min 0.3, default 0.305, max 6.3

## Placement (name value [footprint] x y rotation side)
BAT1  -  [HDR-TH_2P-P2.54-V-M-1]  4.2 8.28 180 top
C1  100nF  [C1206]  12.47 6.38 90 top
C2  1nF  [C0603]  6.13 4.17 0 top
D1  1N4148WS  [SOD-323_L1.8-W1.3-LS2.5-RD]  9.51 8.11 180 top
L1  220uH  [IND-SMD_L3.0-W3.0_LVS303015H-2R2M-N]  16.08 8.28 270 top
L2  220uH  [L1207]  18.5 8.24 90 top
LED1  XL-1608UPC-06  [LED0603-RD_PINK]  2.95 4.19 180 top
PWM1  -  [HDR-TH_2P-P2.54-V-M-1]  4.15 1.76 180 top
Q1  MMBT5551  [SOT-23-3_L2.9-W1.3-P1.90-LS2.4-BR]  12.01 1.76 180 top
Q2  MMBT5551  [SOT-23-3_L2.9-W1.3-P1.90-LS2.4-BR]  9.51 5.15 270 top
R1  1K  [R0603]  8.41 1.76 90 top
R2  1K  [R0603]  6.14 5.96 0 top
R3  3.3kΩ  [R0603]  3 5.96 0 top
TEST1  -  [HDR-TH_2P-P2.54-V-M-1]  15.71 3.03 270 top

## Footprints (pads in the part's own frame, mm; a bottom-side part is the same pattern mirrored in y, then rotated)
C0603
  rect 0.8x0.9 smd: 1(-0.7,0) 2(0.7,0)
C1206
  rect 1.485x1.728 smd: 1(-1.593,0) 2(1.593,0)
HDR-TH_2P-P2.54-V-M-1
  rect 1.8x1.8 hole 1: 1(-1.27,0)
  round 1.8 hole 1: 2(1.27,0)
IND-SMD_L3.0-W3.0_LVS303015H-2R2M-N
  rect 1.5x3.32 smd: 1(1.15,0) 2(-1.15,0)
L1207
  rect 1.2x2 smd: 1(-1.25,0) 2(1.25,0)
LED0603-RD_PINK
  rect 0.8x0.8 smd: 1(-0.799,-0.004) 2(0.799,0.004)
R0603
  rect 0.806x0.864 smd: 1(-0.753,0) 2(0.753,0)
SOD-323_L1.8-W1.3-LS2.5-RD
  rect 1x0.75 smd: 1(-1.173,0) 2(1.173,0)
SOT-23-3_L2.9-W1.3-P1.90-LS2.4-BR
  rect 1.25x0.7 smd: 1(1,-0.95) 2(1,0.95) 3(-1,0)

## Nets
As in the schematic.

## Via types
v1: diameter 0.61, hole 0.305, Top Layer to Bottom Layer, 8 vias

## Routing (per net, layer and track width the routed paths; a pad name or vN(x,y) marks a point on that pad's centre or on a via; arc(x,y) is an arc through that point)
GND:
  vias: v1(3.75,4.19) v1(10.47,4.57) v1(10.48,3.78) v1(12.47,7.98)
VCC: length 14.3
  Top Layer w0.635: L1.2 15.84,9.68 6.93,9.68 5.53,8.28 BAT1.1 5.47,7.68 R3.2
NET1: length 5.4
  Top Layer w0.635: PWM1.2 5.29,4.17 C2.1 5.38,4.21 R2.1
NET2: length 3.3
  Top Layer w0.635: PWM1.1 6.17,1.01 R1.1
NET3: length 8
  Top Layer w0.635: D1.1 10.69,5.79 11.94,4.53 15.48,4.53 TEST1.1
NET4: length 2.7
  Top Layer w0.635: Q1.3 15.7,1.76 TEST1.2
$1N914: length 3.6
  Top Layer w0.635: Q2.1 8.55,4.17 C2.2 6.89,4.23 R2.2
$1N925: length 2.7
  Top Layer w0.635: 11.01,2.71 10.81,2.52 R1.2
$1N950: length 1.8
  Top Layer w0.635: R3.1 2.25,4.28 LED1.2
$1N1295: length 10
  Top Layer w0.635: v1(9.51,6.15) v1(9.51,6.93) D1.2 ; 18.44,9.29 18.5,9.23
  Bottom Layer w0.635: v1(16.08,7.13) 15.19,7.13 v1(15.1,7.04) 14.99,6.93 v1(9.51,6.93) v1(9.51,6.15)

## Copper pours and planes (outline as drawn; the poured copper is in the pictures)
GND on Top Layer: -1.75,12.27 21.32,12.27 21.32,-1.32 -1.75,-1.32
GND on Bottom Layer: -0.98,11.11 25.35,11.11 25.35,-4.32 -0.98,-4.32

Small or netless copper shapes (teardrops, artwork), in the pictures only: 26 on Top Layer, 2 on Bottom Layer

## Text on the board
Bottom Silkscreen Layer: BOOST | CTRL | GND | VCC | OUT | openTENS | 1.0 by 0ingChun | Copyright (c) 2022 | Research Only! | 单向脉冲版 | 电刺激
Top Silkscreen Layer: OUT

# Board PCB4
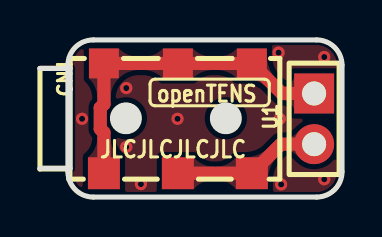
[diagram p8: board, top side]
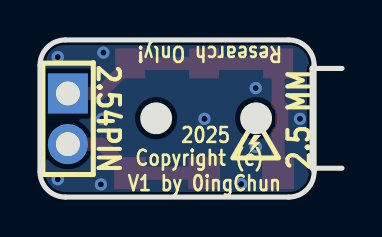
[diagram p9: board, bottom side, seen from below]

Outline 15.11 x 7.87 mm; copper layers: Top Layer, Bottom Layer. Coordinates in mm from the lower left corner of the outline.
Outline path: 1.4,6.6 1.4,1.27 arc(1.77,0.37) 2.67,0 13.84,0 arc(14.74,0.37) 15.11,1.27 15.11,6.6 arc(14.74,7.5) 13.84,7.87 2.67,7.87 arc(1.77,7.5) 1.4,6.6
Stack: Top Layer 0.035mm / Dielectric1 1.51mm FR4 er 4.5 / Bottom Layer 0.035mm

## Design rules (mm)
template: JLCPCB Capability(Two Layers Board)
spacing copperThickness1oz (default): track to track 0.102, other pairs 0.152 to 0.3
spacing copperThickness2oz: track to track 0.203, other pairs 0.152 to 0.3
track width copperThickness1oz (default): min 0.127, default 0.254, max 2.54
track width copperThickness2oz: min 0.203, default 0.254, max 2.54
differential pair differentialPair (default): width min 0.127, default 0.254, max 2.54; gap min 0.152, default 0.152
via viaSize (default): diameter min 0.5, default 0.61, max 10; hole min 0.3, default 0.305, max 6.3

## Placement (name value [footprint] x y rotation side)
CN1  PJ-242D-SMT  [AUDIO-SMD_PJ-242D-SMT]  6.9 3.95 0 top
U1  FH2.54-09-02PZD  [HDR-TH_2P-P2.54-V-M-5]  13.72 3.92 270 top

## Footprints (pads in the part's own frame, mm; a bottom-side part is the same pattern mirrored in y, then rotated)
AUDIO-SMD_PJ-242D-SMT
  rect 1.5x1.5 smd: 1(-3.7,2.75) 3(0,2.75) 11(3.7,2.75)
  rect 1.6x1.6 smd: 2(0,-2.75) 4(-3.7,-2.75) 10(3.7,-2.75)
HDR-TH_2P-P2.54-V-M-5
  rect 2x2 hole 1.2: 1(-1.27,0)
  round 2 hole 1.2: 2(1.27,0)

## Nets
As in the schematic.

## Via types
v1: diameter 0.61, hole 0.305, Top Layer to Bottom Layer, 10 vias

## Routing (per net, layer and track width the routed paths; a pad name or vN(x,y) marks a point on that pad's centre or on a via; arc(x,y) is an arc through that point)
GND:
  vias: v1(2.11,3.92) v1(4.32,5.46) v1(4.32,2.51) v1(5.05,0.65) v1(6.88,3.92) v1(11.94,7.24) v1(12,3.92) v1(12.07,0.63) v1(14.22,7.02) v1(14.22,0.89)
OUT1: length 16.8
  Top Layer w0.66: U1.1 12.11,5.19 10.6,6.7 CN1.3 CN1.1 3.2,4.66 3.02,4.48 3.02,3.41 3.2,3.23 CN1.4
OUT2: length 7.4
  Top Layer w0.66: CN1.2 10.6,1.2 12.06,2.65 U1.2

## Copper pours and planes (outline as drawn; the poured copper is in the pictures)
GND on Top Layer: -3.43,10.67 15.75,10.67 15.75,-4.19 -3.43,-4.19
GND on Bottom Layer: -2.03,9.27 16.76,9.27 16.76,-1.78 -2.03,-1.78

Small or netless copper shapes (teardrops, artwork), in the pictures only: 12 on Top Layer

## Text on the board
Bottom Silkscreen Layer: V1 by 0ingChun | Research Only! | 2025 | Copyright (c) | 2.54PIN | 2.5 MM
Top Silkscreen Layer: openTENS | JLCJLCJLCJLC

# Board PCB3
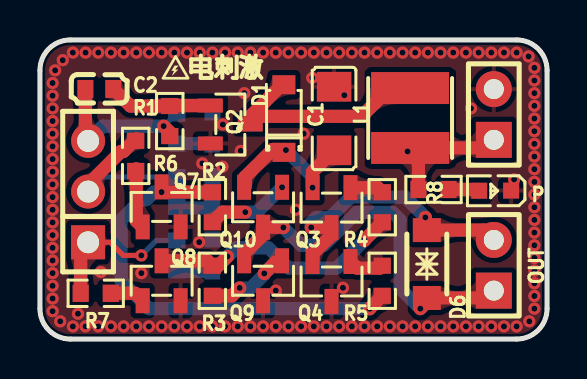
[diagram p10: board, top side]
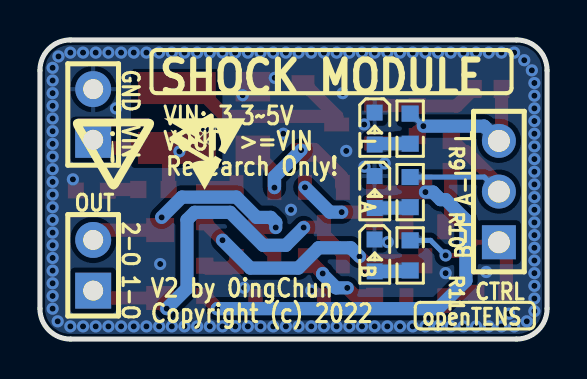
[diagram p11: board, bottom side, seen from below]

Outline 25.4 x 14.99 mm; copper layers: Top Layer, Bottom Layer. Coordinates in mm from the lower left corner of the outline.
Outline path: 0,13.46 0,1.52 arc(0.45,0.45) 1.52,0 23.88,0 arc(24.95,0.45) 25.4,1.52 25.4,13.46 arc(24.95,14.54) 23.88,14.99 1.52,14.99 arc(0.45,14.54) 0,13.46
Stack: Top Layer 0.035mm / Dielectric1 1.51mm FR4 er 4.5 / Bottom Layer 0.035mm

## Design rules (mm)
template: JLCPCB Capability(Two Layers Board)
spacing copperThickness1oz (default): track to track 0.102, other pairs 0.152 to 0.3
spacing copperThickness2oz: track to track 0.203, other pairs 0.152 to 0.3
track width copperThickness1oz (default): min 0.127, default 0.254, max 2.54
track width copperThickness2oz: min 0.203, default 0.254, max 2.54
differential pair differentialPair (default): width min 0.127, default 0.254, max 2.54; gap min 0.152, default 0.152
via viaSize (default): diameter min 0.5, default 0.61, max 10; hole min 0.3, default 0.305, max 6.3

## Placement (name value [footprint] x y rotation side)
A  XL-1608UPC-06  [LED0603-RD_PINK]  8.64 7.37 270 bottom
B  XL-1608UPC-06  [LED0603-RD_PINK]  8.64 4.19 270 bottom
BAT  -  [HDR-TH_2P-P2.54-V-M-1]  22.73 11.25 90 top
C1  4.7uF  [C1206]  14.73 11.05 270 top
C2  1nF  [C0603]  2.98 12.53 0 top
D1  1N4148W  [SOD-123_L2.8-W1.8-LS3.7-RD]  12.22 11.05 90 top
D6  SMF100CA  [SOD-123FL_L2.8-W1.8-LS3.7-BI]  19.38 3.76 270 top
L  XL-1608UPC-06  [LED0603-RD_PINK]  8.64 10.54 270 bottom
L1  330uH  [IND-SMD_L4.0-W4.0_FNR40XXS]  18.54 11.07 270 top
OUT  -  [HDR-TH_2P-P2.54-V-M-1]  22.73 3.7 90 top
P  XL-1608UPC-06  [LED0603-RD_PINK]  22.8 7.44 180 top
PWM  -  [HDR-TH_3P-P2.54-V-M]  2.41 7.39 90 top
Q2  MMBT5551  [SOT-23-3_L2.9-W1.3-P1.90-LS2.4-BR]  9.54 10.75 180 top
Q3  MMBT5401  [SOT-23-3_L2.9-W1.3-P1.90-LS2.4-BR]  14.6 6.59 90 top
Q4  MMBT5401  [SOT-23-3_L2.9-W1.3-P1.90-LS2.4-BR]  14.6 2.89 90 top
Q7  MMBT5551  [SOT-23-3_L2.9-W1.3-P1.90-LS2.4-BR]  6.1 6.62 270 top
Q8  MMBT5551  [SOT-23-3_L2.9-W1.3-P1.90-LS2.4-BR]  6.1 2.92 270 top
Q9  MMBT5401  [SOT-23-3_L2.9-W1.3-P1.90-LS2.4-BR]  11.18 2.92 90 top
Q10  MMBT5401  [SOT-23-3_L2.9-W1.3-P1.90-LS2.4-BR]  11.18 6.6 90 top
R1  1K  [R0603]  6.5 10.92 90 top
R2  33K  [R0603]  8.64 6.6 270 top
R3  33K  [R0603]  8.64 2.92 270 top
R4  33K  [R0603]  17.14 6.6 270 top
R5  33K  [R0603]  17.14 2.92 270 top
R6  1K  [R0603]  4.8 9.17 270 top
R7  1K  [R0603]  2.79 2.29 0 top
R8  3.3kΩ  [R0603]  19.71 7.49 180 top
R9  3.3kΩ  [R0603]  6.86 10.54 90 bottom
R10  3.3kΩ  [R0603]  6.86 7.36 90 bottom
R11  3.3kΩ  [R0603]  6.86 4.19 90 bottom

## Footprints (pads in the part's own frame, mm; a bottom-side part is the same pattern mirrored in y, then rotated)
C0603
  rect 0.8x0.9 smd: 1(-0.7,0) 2(0.7,0)
C1206
  rect 1.485x1.728 smd: 1(-1.593,0) 2(1.593,0)
HDR-TH_2P-P2.54-V-M-1
  rect 1.8x1.8 hole 1: 1(-1.27,0)
  round 1.8 hole 1: 2(1.27,0)
HDR-TH_3P-P2.54-V-M
  rect 1.7x1.7 hole 1.1: 1(-2.54,0)
  round 1.7 hole 1.1: 2(0,0) 3(2.54,0)
IND-SMD_L4.0-W4.0_FNR40XXS
  rect 1.6x3.9 smd: 1(-1.5,0) 2(1.5,0)
LED0603-RD_PINK
  rect 0.8x0.8 smd: 1(-0.799,-0.004) 2(0.799,0.004)
R0603
  rect 0.806x0.864 smd: 1(-0.753,0) 2(0.753,0)
SOD-123_L2.8-W1.8-LS3.7-RD
  rect 0.95x1.15 smd: 1(-1.692,0) 2(1.692,0)
SOD-123FL_L2.8-W1.8-LS3.7-BI
  rect 1.2x1.4 smd: 1(-1.7,0) 2(1.7,0)
SOT-23-3_L2.9-W1.3-P1.90-LS2.4-BR
  rect 1.25x0.7 smd: 1(1,-0.95) 2(1,0.95) 3(-1,0)

## Nets
As in the schematic.

## Via types
v1: diameter 0.61, hole 0.305, Top Layer to Bottom Layer, 151 vias

## Routing (per net, layer and track width the routed paths; a pad name or vN(x,y) marks a point on that pad's centre or on a via; arc(x,y) is an arc through that point)
GND:
  vias: v1(0.63,12.83) v1(0.63,12.19) v1(0.63,11.56) v1(0.63,10.92) v1(0.63,10.29) v1(0.63,9.65) v1(0.63,9.02) v1(0.63,8.38) v1(0.63,7.75) v1(0.63,7.11) v1(0.63,6.48) v1(0.63,5.84) v1(0.63,5.21) v1(0.63,4.57) v1(0.63,3.94) v1(0.63,3.3) v1(0.63,2.67) v1(0.63,2.03) v1(0.63,1.4) v1(0.76,13.46) v1(1.02,0.89) v1(1.14,13.97) v1(1.65,14.35) v1(1.65,0.63) v1(1.91,1.27) v1(2.29,14.35) v1(2.29,0.63) v1(2.92,14.35) v1(2.92,0.63) v1(3.05,3.36) v1(3.56,14.35) v1(3.56,0.63) v1(4.19,14.35) v1(4.19,0.63) v1(4.83,14.35) v1(4.83,0.63) v1(5.08,3.3) v1(5.46,14.35) v1(5.46,0.63) v1(6.1,14.35) v1(6.1,0.63) v1(6.73,14.35) v1(6.73,0.63) v1(7.37,14.35) v1(7.37,0.63) v1(8,14.35) v1(7.98,4.86) v1(8,0.63) v1(8.13,8.8) v1(8.64,14.35) v1(8.64,0.63) v1(9.16,10.75) v1(9.14,8.64) v1(9.27,14.35) v1(9.27,0.63) v1(9.91,14.35) v1(9.91,0.63) v1(10.06,9.43) v1(10.24,12.32) v1(10.54,14.35) v1(10.54,0.63) v1(11.18,14.35) v1(11.18,0.63) v1(11.81,14.35) v1(11.81,2.43) v1(11.81,0.63) v1(12.45,14.35) v1(12.45,0.63) v1(12.83,6.48) v1(13.08,14.35) v1(13.08,0.63) v1(13.21,10.29) v1(13.72,14.35) v1(13.64,13.09) v1(13.72,0.63) v1(14.35,14.35) v1(14.35,0.63) v1(14.99,14.35) v1(14.99,0.63) v1(15.18,2.57) v1(15.25,12.22) v1(15.62,14.35) v1(15.62,0.63) v1(16.26,14.35) v1(16.26,0.63) v1(16.89,14.35) v1(16.89,0.63) v1(17.53,14.35) v1(17.53,0.63) v1(18.16,14.35) v1(18.16,0.63) v1(18.8,14.35) v1(18.8,0.63) v1(19.43,14.35) v1(19.38,3.76) v1(19.43,0.63) v1(20.07,14.35) v1(20.07,0.63) v1(20.7,14.35) v1(20.7,0.63) v1(21.34,14.35) v1(21.34,0.63) v1(21.59,11.56) v1(21.97,14.35) v1(21.97,0.63) v1(22.61,14.35) v1(22.61,0.63) v1(23.24,14.35) v1(23.24,0.63) v1(23.75,8) v1(23.88,14.35) v1(23.88,0.63) v1(24.47,14.16) v1(24.51,0.89) v1(24.76,13.59) v1(24.76,12.95) v1(24.76,12.32) v1(24.76,11.68) v1(24.76,11.05) v1(24.76,10.41) v1(24.76,9.78) v1(24.76,9.14) v1(24.76,8.51) v1(24.76,7.87) v1(24.76,7.24) v1(24.76,6.6) v1(24.76,5.97) v1(24.76,5.33) v1(24.76,4.7) v1(24.76,4.06) v1(24.76,3.43) v1(24.76,2.79) v1(24.76,2.16) v1(24.76,1.52)
VCC: length 6.5
  Top Layer w0.66: L1.2 22.33,9.57 BAT.1 ; R8.2 18.96,8.85 v1(18.41,9.4) 18.4,9.39
IN1: length 8.5
  Top Layer w0.66: 4.83,10.04 4.18,9.4 4.06,9.4 2.41,7.75 PWM.2
  Bottom Layer w0.254: R10.2 3.14,8.11 PWM.2
IN2: length 7.7
  Top Layer w0.254: v1(5.08,4.19) 4.17,4.19 3.52,4.85 PWM.1
  Top Layer w0.66: PWM.1 2.04,4.48 R7.1
  Bottom Layer w0.254: v1(5.08,4.19) 5.83,4.94 R11.2
L-BOOST: length 8.3
  Top Layer w0.66: R1.1 6.5,10.36 v1(6.2,10.67) ; C2.1 2.28,10.06 PWM.3
  Bottom Layer w0.254: v1(6.2,10.67) 6.82,11.29 R9.2
  Bottom Layer w0.66: PWM.3 3.15,10.67 v1(6.2,10.67)
OUT1: length 19.3
  Top Layer w0.66: v1(12.19,5.59) 12.18,5.6 Q10.3 11.18,5.23 10.23,4.28 Q9.2 ; 19.59,2.06 22.37,2.06 22.73,2.43 ; 19.59,2.06 D6.2 ; 19.59,2.06 v1(19.05,1.52)
  Bottom Layer w0.66: v1(19.05,1.52) 18.03,2.54 18.03,5.97 17.65,6.35 15.88,6.35 14.22,4.7 13.08,4.7 v1(12.19,5.59)
OUT2: length 14.2
  Top Layer w0.66: Q3.3 14.6,5.21 13.66,4.26 Q4.2 ; v1(13.59,5.59) 14.6,5.59 ; 19.3,5.46 v1(19.3,6.1) ; 19.38,5.46 22.24,5.46 OUT.2
  Bottom Layer w0.66: v1(13.59,5.59) 13.59,5.84 13.84,6.1 14.54,6.1 15.56,7.11 18.29,7.11 v1(19.3,6.1)
$1N633: length 5.2
  Top Layer w0.66: Q2.1 6.53,11.7 R1.2 4.53,11.68 C2.2
$1N635: length 7.8
  Top Layer w0.66: 10.29,7.66 10.29,8.13 11.65,9.5 12.29,9.5 v1(12.32,9.47) ; C1.2 13.66,8.38 v1(13.66,7.59)
  Bottom Layer w0.66: v1(12.32,9.47) 13.66,8.13 v1(13.66,7.59)
$1N636: length 4.2
  Top Layer w0.66: v1(10.29,6.36) 9.14,6.36 R2.2
  Bottom Layer w0.66: v1(12.13,7.6) 10.88,6.36 v1(10.29,6.36)
$1N637: length 1.8
  Top Layer w0.66: R5.1 17.03,3.56 15.88,3.56 Q4.1
$1N638: length 4.2
  Top Layer w0.66: v1(10.01,2.56) 9.61,2.17 R3.2 ; v1(11.24,3.29) 11.79,3.84 12.05,3.84 Q9.1
  Bottom Layer w0.66: v1(10.01,2.56) 10.56,2.56 11.24,3.24 v1(11.24,3.29)
$1N639: length 21.9
  Top Layer w0.66: v1(16.52,1.52) 16.52,1.54 R5.2 ; 8.38,7.36 v1(6.09,7.36)
  Bottom Layer w0.66: v1(16.52,1.52) 16.51,1.52 5.46,1.52 4.06,2.92 4.06,5.97 5.08,6.98 5.33,6.98 5.71,7.36 v1(6.09,7.36)
$1N640: length 1.7
  Top Layer w0.66: R4.1 16.92,7.59 Q3.1
$1N641: length 12.9
  Top Layer w0.66: R4.2 16.26,4.96 v1(16.26,4.95) ; v1(9.39,4.14) 8.93,3.67 R3.1 8.39,3.92 Q8.3
  Bottom Layer w0.66: v1(9.39,4.14) 9.83,4.57 11.44,4.57 12.46,3.56 14.86,3.56 v1(16.26,4.95)
$1N644: length 3.1
  Top Layer w0.66: 4.83,8.53 4.83,5.92 5.15,5.6
$1N645: length 1.8
  Top Layer w0.66: R7.2 4.77,2.29 Q8.1
$1N1569: length 11.3
  Top Layer w0.66: 10.54,11.16 16.11,11.16 17.53,12.57 18.54,12.57 ; 10.54,11.16 12.12,12.74 D1.2 ; 10.54,11.16 Q2.3
$1N3237: length 1.6
  Top Layer w0.66: P.2 21.94,7.49 R8.1
$1N5710: length 1.8
  Bottom Layer w0.66: L.2 8.59,9.79 R9.1
$1N5808: length 1.8
  Bottom Layer w0.66: R10.1 6.9,6.57 A.2
$1N5903: length 1.8
  Bottom Layer w0.66: B.2 6.9,3.39 R11.1

## Copper pours and planes (outline as drawn; the poured copper is in the pictures)
GND on Top Layer: -0.76,15.49 25.65,15.49 25.65,-0.76 -0.76,-0.76
GND on Bottom Layer: -0.51,16 26.03,16 26.03,-0.38 -0.51,-0.38

Small or netless copper shapes (teardrops, artwork), in the pictures only: 51 on Top Layer, 15 on Bottom Layer

## Text on the board
Bottom Silkscreen Layer: GND | VIN | L | A-I | B-I | 2-O | 1-O | CTRL | openTENS | OUT | Research Only! | VIN: 3.3~5V | VOUT: >=VIN | V2 by 0ingChun | Copyright (c) 2022 | SHOCK MODULE
Top Silkscreen Layer: 电刺激
